# Altium project S7CAS-PLEIADES-CARTE-MERE_P06.PrjPcb (part 1 of 4)
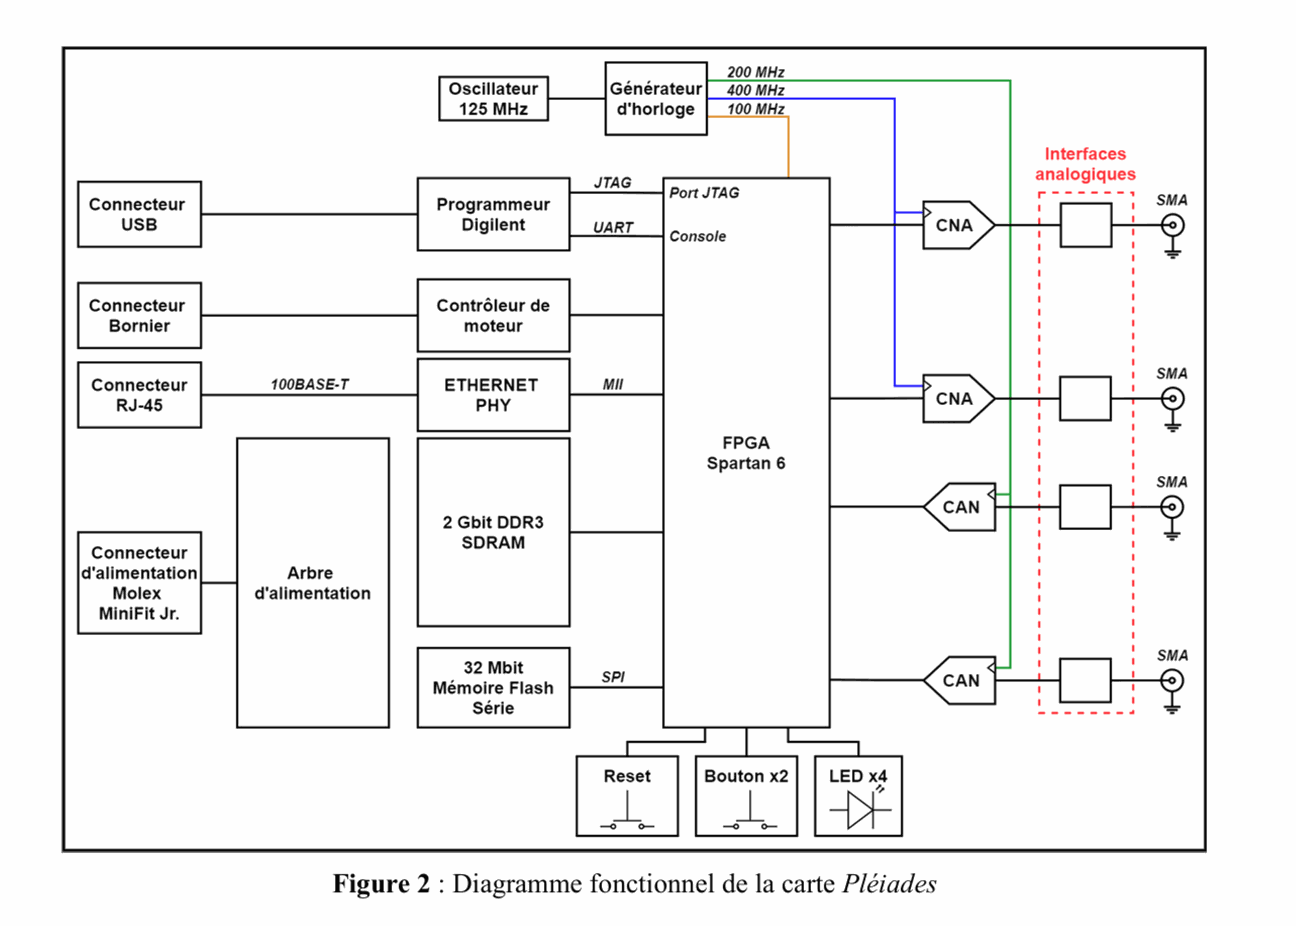
[diagram p0: S7CAS-PLEIADES-CARTE-MERE_P06_BLOCK_DIAGRAM.SchDoc]
Project_Date: 2026-01-21; Project_Designer1: Étienne Provencher; Project_Designer2: Antoine Allard; Project_Global: S7APP1-2; Project_Group: P-06; Project_Name: S7CAS-PLEIDES-CARTE-MERE_P06; Project_Revision: 1.00; Project_Stencil_Bot_Thickness: 3 Milliwhatever; Project_Stencil_Top_Thickness: 6-7 MacroMilsliliter
18 sheets, 469 parts. Net scope: flat (ports and power ports of the same name join across sheets).
Board file: S7CAS-PLEIADES-CARTE-MERE_P06.PcbDoc
Sheets:
  S7CAS-PLEIADES-CARTE-MERE_P06_TITLE.SchDoc
  S7CAS-PLEIADES-CARTE-MERE_P06_BLOCK_DIAGRAM.SchDoc
  S7CAS-PLEIADES-CARTE-MERE_P06_POWER_TREE.SchDoc
  S7CAS-PLEIADES-CARTE-MERE_P06_POWER1.SCHDOC
  S7CAS-PLEIADES-CARTE-MERE_P06_POWER2.SCHDOC
  S7CAS-PLEIADES-CARTE-MERE_P06_FPGA1.SCHDOC
  S7CAS-PLEIADES-CARTE-MERE_P06_FPGA2.SCHDOC
  S7CAS-PLEIADES-CARTE-MERE_P06_FPGA3.SCHDOC
  S7CAS-PLEIADES-CARTE-MERE_P06_FPGA4.SCHDOC
  S7CAS-PLEIADES-CARTE-MERE_P06_CLOCK.SchDoc
  S7CAS-PLEIADES-CARTE-MERE_P06_ETHERNET.SCHDOC
  S7CAS-PLEIADES-CARTE-MERE_P06_DDR3.SCHDOC
  S7CAS-PLEIADES-CARTE-MERE_P06_MOTOR.SCHDOC
  S7CAS-PLEIADES-CARTE-MERE_P06_MISC.SchDoc
  S7CAS-PLEIADES-CARTE-MERE_P06_FLASH.SCHDOC
  S7CAS-PLEIADES-CARTE-MERE_P06_ADC.SchDoc
  S7CAS-PLEIADES-CARTE-MERE_P06_DAC.SchDoc
  S7CAS-PLEIADES-CARTE-MERE_P06_USB_PROGRAMER.SCHDOC

## Sheet S7CAS-PLEIADES-CARTE-MERE_P06_TITLE.SchDoc
size Tabloid; SheetNumber: 1; SheetTotal: 18; Sheet_Name: Title; Size: 11x17

### Notes on the sheet
- Revision history
- Package size conversion
- Metric
- 1005
- 1608
- Imperial
- 0402
- 0603
- Revision
- 2012
- 3216
- 0805
- 1206
- 3225
- 6432
- 1210
- 2512
- Date :
- Project Title
- Global Project
- Size
- Group
- Date
- Sheet
- of
- Filename
- Designers

## Sheet S7CAS-PLEIADES-CARTE-MERE_P06_BLOCK_DIAGRAM.SchDoc
size Tabloid; SheetNumber: 2; SheetTotal: 17; Sheet_Name: BLOCK DIAGRAM; Size: 11x17

### Notes on the sheet
- Sheet Name
- Project Title
- Global Project
- Size
- Group
- Revision
- Date
- Sheet
- of
- Filename
- Designers

## Sheet S7CAS-PLEIADES-CARTE-MERE_P06_POWER_TREE.SchDoc
size Tabloid; SheetNumber: 3; SheetTotal: 18; Sheet_Name: POWER TREE; Size: 11x17
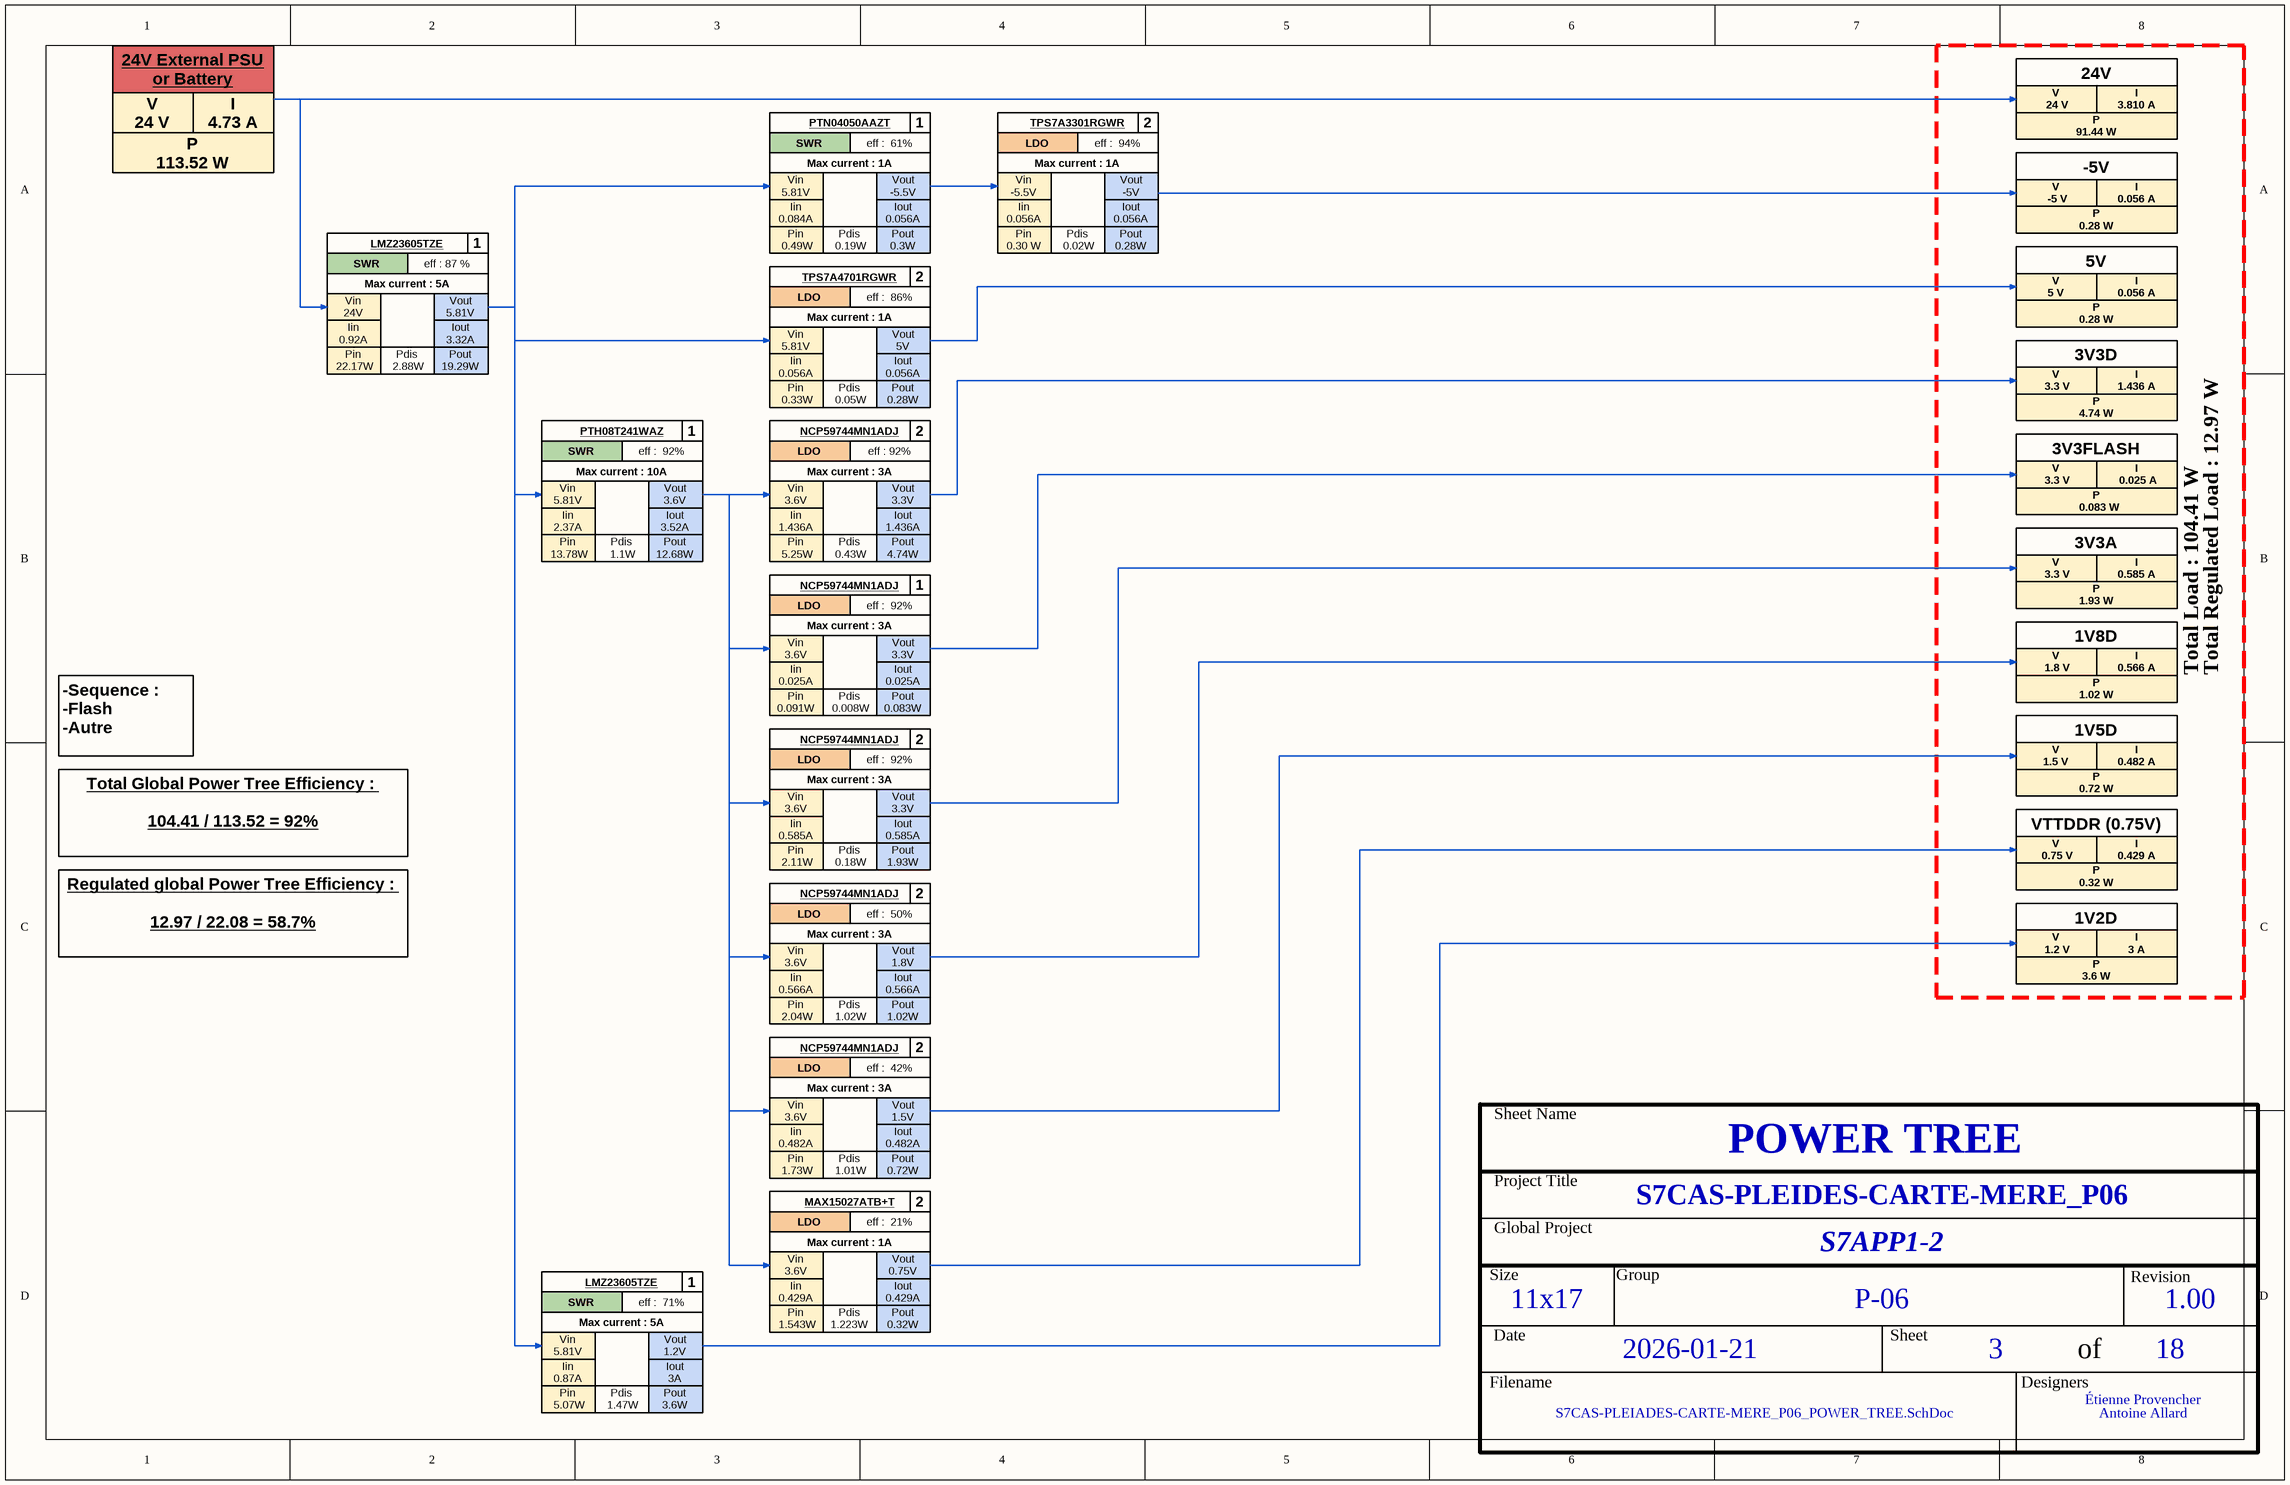
[diagram p1: S7CAS-PLEIADES-CARTE-MERE_P06_POWER_TREE.SchDoc]

### Notes on the sheet
- 24V External PSU
  or Battery
- 24V
- V
  24 V
- P
  113.52 W
- I
  4.73 A
- PTN04050AAZT
- SWR
- Max current : 1A
- eff :  61%
- 1
- LDO
- TPS7A3301RGWR
- eff :  94%
- 2
- P
  91.44 W
- I
  3.810 A
- Vin
  5.81V
- Iin
  0.084A
- Vout
  -5.5V
- Iout
  0.056A
- Vin
  -5.5V
- Iin
  0.056A
- Vout
  -5V
- -5V
- V
  -5 V
- P
  0.28 W
- I
  0.056 A
- LMZ23605TZE
- Max current : 5A
- eff : 87 %
- Pin
  0.49W
- TPS7A4701RGWR
- Pdis
  0.19W
- eff :  86%
- Pout
  0.3W
- Pin
  0.30 W
- Pdis
  0.02W
- Pout
  0.28W
- 5V
- V
  5 V
- Vin
  24V
- Iin
  0.92A
- Vout
  5.81V
- Iout
  3.32A
- Vout
  5V
- 3V3D
- Pin
  22.17W
- Pdis
  2.88W
- Pout
  19.29W
- PTH08T241WAZ
- Pin
  0.33W
- NCP59744MN1ADJ
- Pdis
  0.05W
- V
  3.3 V
- P
  4.74 W
- I
  1.436 A
- Max current : 10A
- eff :  92%
- Max current : 3A
- eff : 92%
- 3V3FLASH
- I
  0.025 A
- Iin
  2.37A
- Pin
  13.78W
- Pdis
  1.1W
- Vout
  3.6V
- Iout
  3.52A
- Pout
  12.68W
- Vin
  3.6V
- Iin
  1.436A
- Pin
  5.25W
- Pdis
  0.43W
- Vout
  3.3V
- Iout
  1.436A
- Pout
  4.74W
- 3V3A
- P
  0.083 W
- P
  1.93 W
- I
  0.585 A
- Iin
  0.025A
- Iout
  0.025A
- 1V8D
- V
  1.8 V
- P
  1.02 W
- I
  0.566 A
- Total Load : 104.41 W
- Total Regulated Load : 12.97 W
- -Sequence :
  -Flash
  -Autre
- Pin
  0.091W
- Pdis
  0.008W
- Pout
  0.083W
- 1V5D
- V
  1.5 V
- I
  0.482 A
- Iin
  0.585A
- Iout
  0.585A
- P
  0.72 W
- VTTDDR (0.75V)
- Total Global Power Tree Efficiency :
  104.41 / 113.52 = 92%
- Pin
  2.11W
- Pdis
  0.18W
- Pout
  1.93W
- V
  0.75 V
- P
  0.32 W
- I
  0.429 A
- Regulated global Power Tree Efficiency :
  12.97 / 22.08 = 58.7%
- eff :  50%
- Vout
  1.8V
- 1V2D
- V
  1.2 V
- I
  3 A
- Iin
  0.566A
- Pin
  2.04W
- Pdis
  1.02W
- Iout
  0.566A
- Pout
  1.02W
- P
  3.6 W
- eff :  42%
- Iin
  0.482A
- Vout
  1.5V
- Iout
  0.482A
- MAX15027ATB+T
- Pin
  1.73W
- Pdis
  1.01W
- eff :  21%
- Pout
  0.72W
- Iin
  0.429A
- Vout
  0.75V
- Iout
  0.429A
- eff :  71%
- Vout
  1.2V
- Pin
  1.543W
- Pdis
  1.223W
- Pout
  0.32W
- Iin
  0.87A
- Pin
  5.07W
- Pdis
  1.47W
- Iout
  3A
- Pout
  3.6W
- Sheet Name
- Project Title
- Global Project
- Size
- Group
- Revision
- Date
- Sheet
- of
- Filename
- Designers

## Sheet S7CAS-PLEIADES-CARTE-MERE_P06_POWER1.SCHDOC
size Tabloid; SheetNumber: 4; SheetTotal: 18; Sheet_Name: POWER 1; Size: 11x17
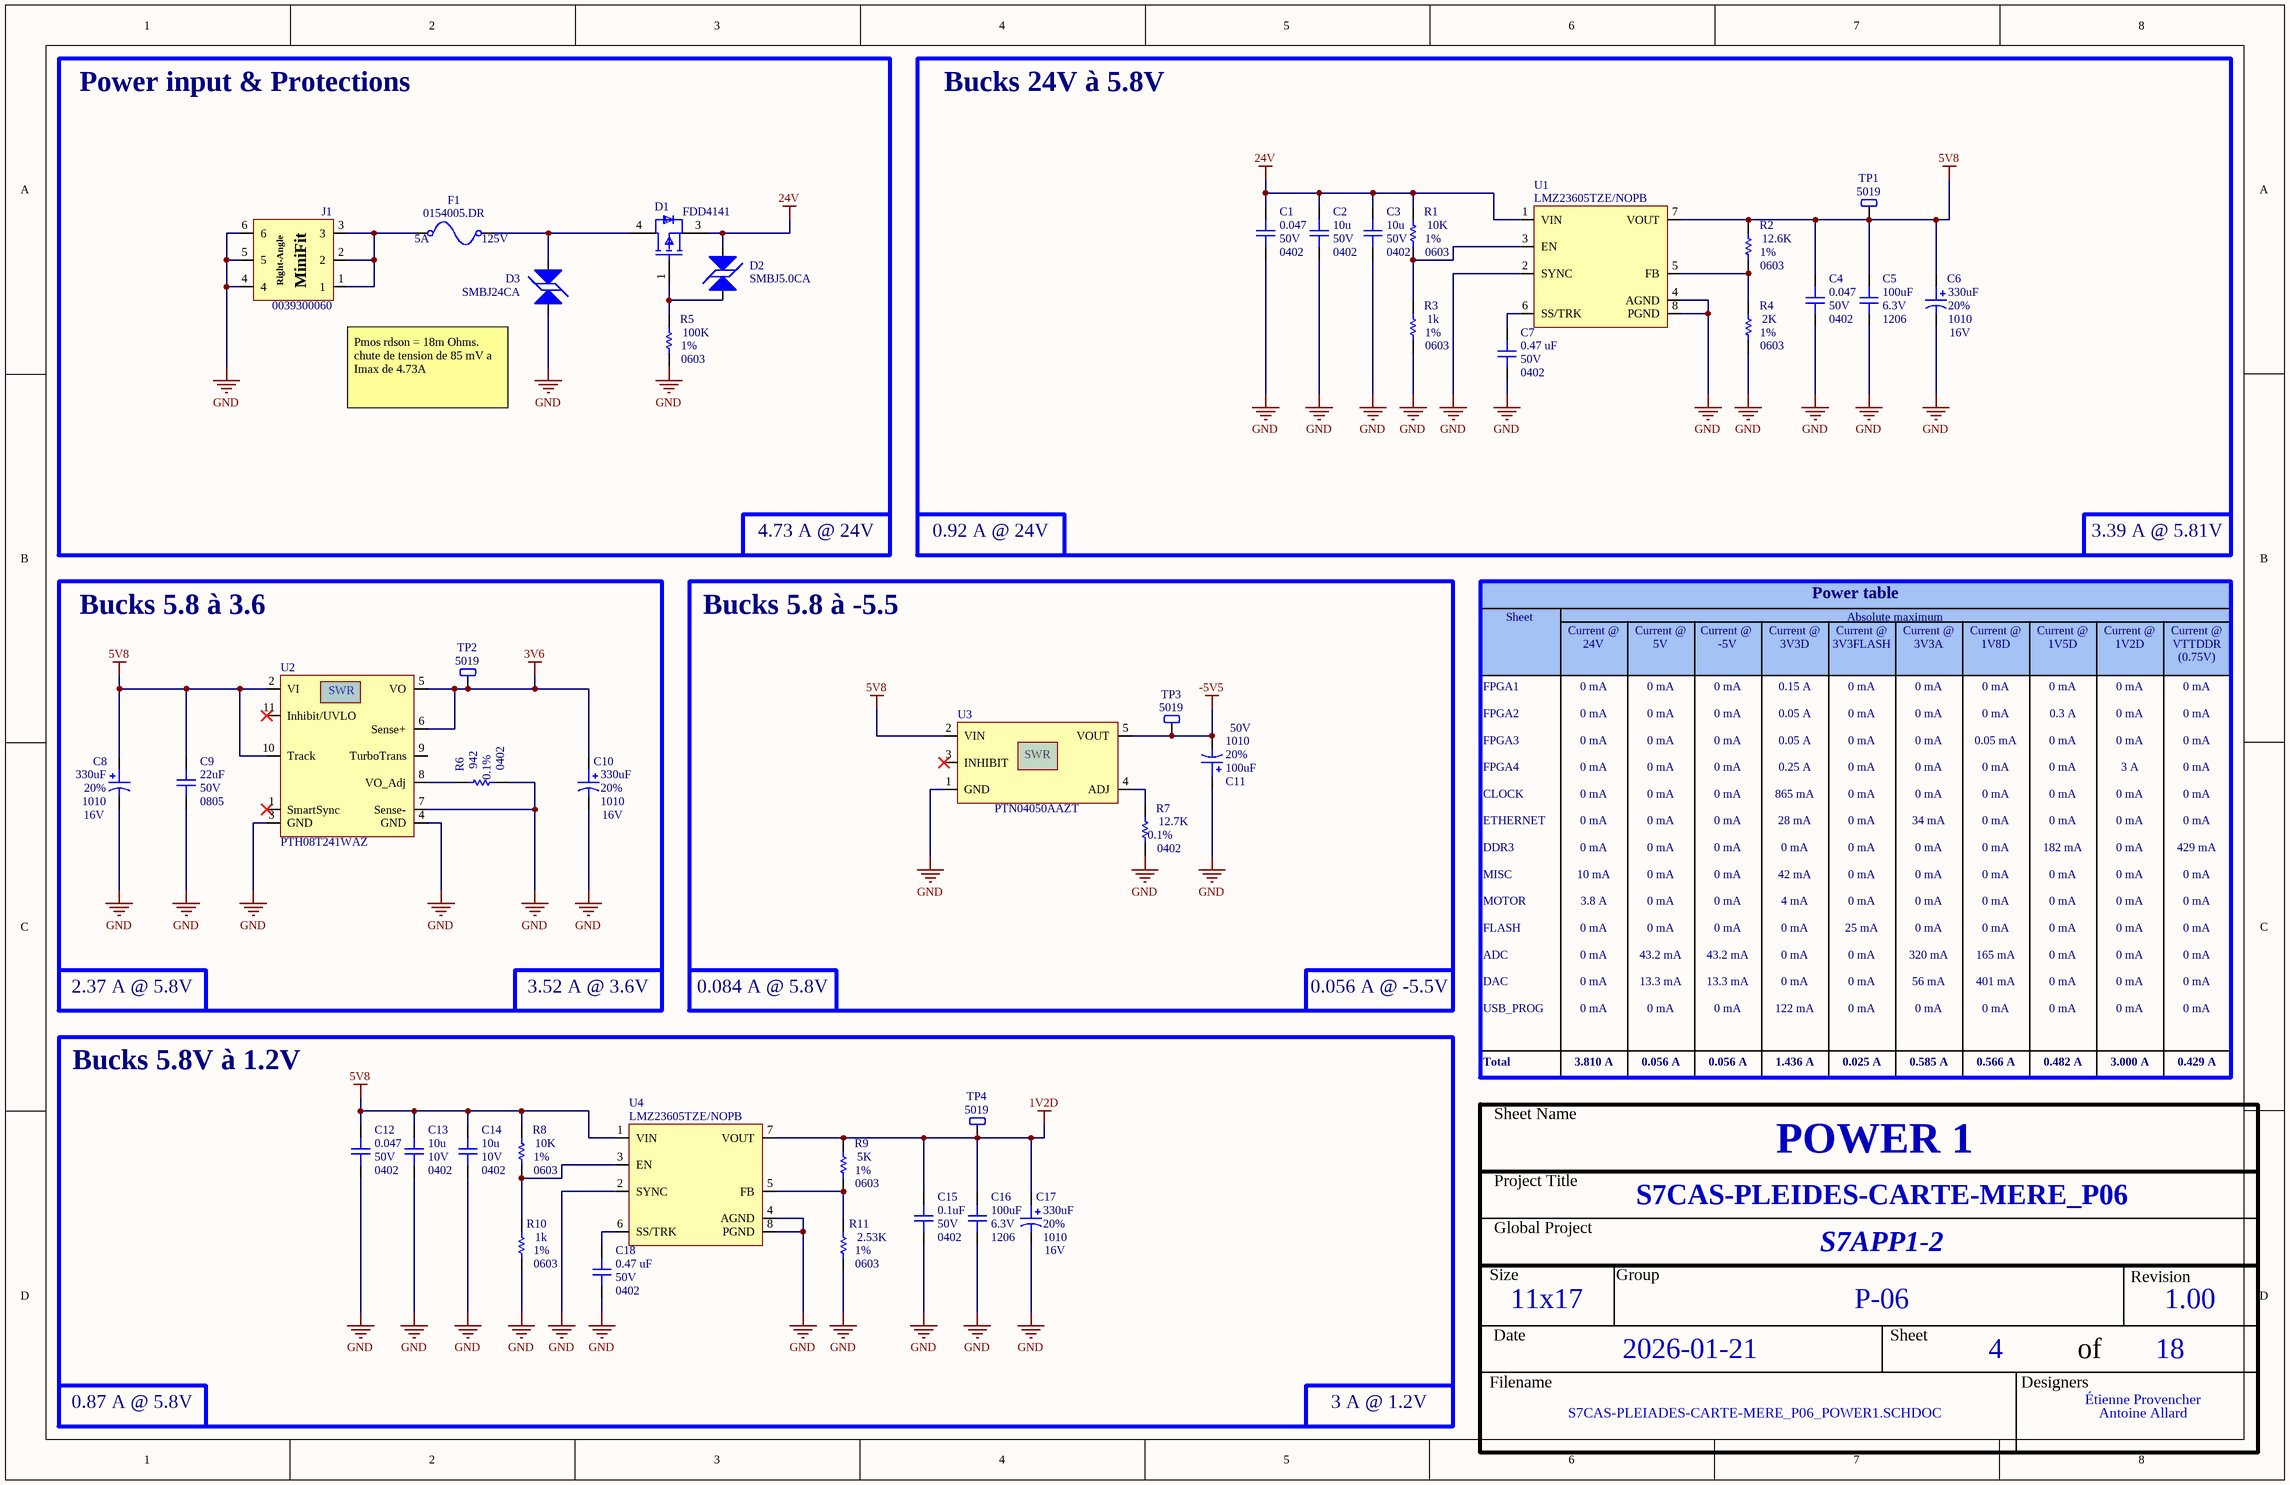
[diagram p2: S7CAS-PLEIADES-CARTE-MERE_P06_POWER1.SCHDOC]

### Parts
C1  value 0.047  Voltage: 50V  Package: 0402  [CAP_0402]  (hidden comment: CAP - 0402)
C2  value 10u  Voltage: 50V  Package: 0402  [CAP_0402]  (hidden comment: CAP - 0402)
C3  value 10u  Voltage: 50V  Package: 0402  [CAP_0402]  (hidden comment: CAP - 0402)
C4  value 0.047  Voltage: 50V  Package: 0402  [CAP_0402]  (hidden comment: CAP - 0402)
C5  value 100uF  Voltage: 6.3V  Package: 1206  [CAP_1206]  (hidden comment: CAP - 1206)
C6  value 330uF  Voltage: 16V  Package: 1010  Precision: 20%  [CAP_ALU_1010_vishay]  (hidden comment: MAL214699501E3)
C7  value 0.47 uF  Voltage: 50V  Package: 0402  [CAP_0402]  (hidden comment: CAP - 0402)
C8  value 330uF  Voltage: 16V  Package: 1010  Precision: 20%  [CAP_ALU_1010_vishay]  (hidden comment: MAL214699501E3)
C9  value 22uF  Voltage: 50V  Package: 0805  [CAP_0805]  (hidden comment: CAP - 0805)
C10  value 330uF  Voltage: 16V  Package: 1010  Precision: 20%  [CAP_ALU_1010_vishay]  (hidden comment: MAL214699501E3)
C11  value 100uF  Voltage: 50V  Package: 1010  Precision: 20%  [CAP_ALU_1010_vishay]  (hidden comment: MAL215099101E3)
C12  value 0.047  Voltage: 50V  Package: 0402  [CAP_0402]  (hidden comment: CAP - 0402)
C13  value 10u  Voltage: 10V  Package: 0402  [CAP_0402]  (hidden comment: CAP - 0402)
C14  value 10u  Voltage: 10V  Package: 0402  [CAP_0402]  (hidden comment: CAP - 0402)
C15  value 0.1uF  Voltage: 50V  Package: 0402  [CAP_0402]  (hidden comment: CAP - 0402)
C16  value 100uF  Voltage: 6.3V  Package: 1206  [CAP_1206]  (hidden comment: CAP - 1206)
C17  value 330uF  Voltage: 16V  Package: 1010  Precision: 20%  [CAP_ALU_1010_vishay]  (hidden comment: MAL214699501E3)
C18  value 0.47 uF  Voltage: 50V  Package: 0402  [CAP_0402]  (hidden comment: CAP - 0402)
D1  FDD4141  [FP-369AS-MFG]
D2  SMBJ5.0CA  [TVS_PWR_SMBJ5.0CA]
D3  SMBJ24CA  [TVS_PWR_SMBJ36CA]
F1  0154005.DR  Voltage Rating: 125V  Current Rating: 5A  [FUS_0154XXX.DR]
J1  0039300060  [CON_MINIFIT_0039300060]
R1  value 10K  Package: 0603  Precision: 1%  [RES_0603]  (hidden comment: RES - 0603)
R2  value 12.6K  Package: 0603  Precision: 1%  [RES_0603]  (hidden comment: RES - 0603)
R3  value 1k  Package: 0603  Precision: 1%  [RES_0603]  (hidden comment: RES - 0603)
R4  value 2K  Package: 0603  Precision: 1%  [RES_0603]  (hidden comment: RES - 0603)
R5  value 100K  Package: 0603  Precision: 1%  [RES_0603]  (hidden comment: RES - 0603)
R6  value 942  Package: 0402  Precision: 0.1%  [RES_0402]  (hidden comment: RES - 0402)
R7  value 12.7K  Package: 0402  Precision: 0.1%  [RES_0402]  (hidden comment: RES - 0402)
R8  value 10K  Package: 0603  Precision: 1%  [RES_0603]  (hidden comment: RES - 0603)
R9  value 5K  Package: 0603  Precision: 1%  [RES_0603]  (hidden comment: RES - 0603)
R10  value 1k  Package: 0603  Precision: 1%  [RES_0603]  (hidden comment: RES - 0603)
R11  value 2.53K  Package: 0603  Precision: 1%  [RES_0603]  (hidden comment: RES - 0603)
TP1  5019  [TPO_SMD_5019]
TP2  5019  [TPO_SMD_5019]
TP3  5019  [TPO_SMD_5019]
TP4  5019  [TPO_SMD_5019]
U1  LMZ23605TZE/NOPB  [REG_SWR_LMZ23605TZE/NOPB]
U2  PTH08T241WAZ  [REG_SWR_PTH08T241WAZ]
U3  PTN04050AAZT  [REG_SWR_PTN04050AAZT]
U4  LMZ23605TZE/NOPB  [REG_SWR_LMZ23605TZE/NOPB]

### Blocks framed on the sheet
Power input & Protections: D1-D3 F1 J1 R5
Bucks 24V à 5.8V: C1-C7 R1-R4 TP1 U1
Bucks 5.8 à 3.6: C8-C10 R6 TP2 U2
Bucks 5.8 à -5.5: C11 R7 TP3 U3
Bucks 5.8V à 1.2V: C12-C18 R8-R11 TP4 U4

### Nets
1V2D: C15.2 C16.2 C17.1 R9.2 TP4.1 U4.7(VOUT)
3V6: C10.1 TP2.1 U2.5(VO) U2.6(Sense+)
5V8: C4.2 C5.2 C6.1 C8.1 C9.2 C12.2 C13.2 C14.2 R2.2 R8.2 TP1.1 U1.7(VOUT) U2.2(VI) U2.10(Track) U3.2(VIN) U4.1(VIN)
24V: C1.2 C2.2 C3.2 D1.3(S) D2.1 R1.2 U1.1(VIN)
-5V5: C11.2 TP3.1 U3.5(VOUT)
GND: C1.1 C2.1 C3.1 C4.1 C5.1 C6.2 C7.1 C8.2 C9.1 C10.2 C11.1 C12.1 C13.1 C14.1 C15.1 C16.1 C17.2 C18.1 D3.2 J1.4 J1.5 J1.6 R3.1 R4.1 R5.1 R6.1 R7.1 R10.1 R11.1 U1.2(SYNC) U1.4(AGND) U1.8(PGND) U2.3(GND) U2.4(GND) U2.7(Sense-) U3.1(GND) U4.2(SYNC) U4.4(AGND) U4.8(PGND)
NetC7_2: C7.2 U1.6(SS/TRK)
NetC18_2: C18.2 U4.6(SS/TRK)
NetD1_1: D1.1(G) D2.2 R5.2
NetD1_4: D1.4(D) D3.1 F1.2
NetF1_1: F1.1 J1.1 J1.2 J1.3
NetR1_1: R1.1 R3.2 U1.3(EN)
NetR2_1: R2.1 R4.2 U1.5(FB)
NetR6_2: R6.2 U2.8(VO_Adj)
NetR7_2: R7.2 U3.4(ADJ)
NetR8_1: R8.1 R10.2 U4.3(EN)
NetR9_1: R9.1 R11.2 U4.5(FB)

Not connected (* = marked no-connect by the designer): U2 1(SmartSync)* 9(TurboTrans) 11(Inhibit/UVLO)*; U3 3(INHIBIT)*

### Notes on the sheet
- Pmos rdson = 18m Ohms. chute de tension de 85 mV a Imax de 4.73A
- 4.73 A @ 24V
- 0.92 A @ 24V
- 3.39 A @ 5.81V
- Power table
- Absolute maximum
- Sheet
- Current @ 24V
- Current @ 5V
- Current @
  -5V
- Current @ 3V3D
- Current @ 3V3FLASH
- Current @ 3V3A
- Current @ 1V8D
- Current @ 1V5D
- Current @ 1V2D
- Current @ VTTDDR
  (0.75V)
- 2.37 A @ 5.8V
- 3.52 A @ 3.6V
- 0.084 A @ 5.8V
- 0.056 A @ -5.5V
- FPGA1
  FPGA2
  FPGA3
  FPGA4
  CLOCK
  ETHERNET
  DDR3
  MISC
  MOTOR
  FLASH
  ADC
  DAC
  USB_PROG
- Total
- 0 mA
  0 mA
  0 mA
  0 mA
  0 mA
  0 mA
  0 mA
  10 mA
  3.8 A
  0 mA
  0 mA
  0 mA
  0 mA
- 3.810 A
- 0.056 A
- 0 mA
  0 mA
  0 mA
  0 mA
  0 mA
  0 mA
  0 mA
  0 mA
  0 mA
  0 mA
  43.2 mA
  13.3 mA
  0 mA
- 1.436 A
- 0.15 A
  0.05 A
  0.05 A
  0.25 A
  865 mA
  28 mA
  0 mA
  42 mA
  4 mA
  0 mA
  0 mA
  0 mA
  122 mA
- 0.025 A
- 0 mA
  0 mA
  0 mA
  0 mA
  0 mA
  0 mA
  0 mA
  0 mA
  0 mA
  25 mA
  0 mA
  0 mA
  0 mA
- 0.585 A
- 0 mA
  0 mA
  0 mA
  0 mA
  0 mA
  34 mA
  0 mA
  0 mA
  0 mA
  0 mA
  320 mA
  56 mA
  0 mA
- 0.566 A
- 0 mA
  0 mA
  0.05 mA
  0 mA
  0 mA
  0 mA
  0 mA
  0 mA
  0 mA
  0 mA
  165 mA
  401 mA
  0 mA
- 0.482 A
- 0 mA
  0.3 A
  0 mA
  0 mA
  0 mA
  0 mA
  182 mA
  0 mA
  0 mA
  0 mA
  0 mA
  0 mA
  0 mA
- 3.000 A
- 0 mA
  0 mA
  0 mA
  3 A
  0 mA
  0 mA
  0 mA
  0 mA
  0 mA
  0 mA
  0 mA
  0 mA
  0 mA
- 0.429 A
- 0 mA
  0 mA
  0 mA
  0 mA
  0 mA
  0 mA
  429 mA
  0 mA
  0 mA
  0 mA
  0 mA
  0 mA
  0 mA
- 0.87 A @ 5.8V
- 3 A @ 1.2V
- Sheet Name
- Project Title
- Global Project
- Size
- Group
- Revision
- Date
- of
- Filename
- Designers
- (in symbol CON_MINIFIT_0039300060) Right-Angle; MiniFit
- (in symbol REG_SWR_PTH08T241WAZ) SWR
- (in symbol REG_SWR_PTN04050AAZT) SWR

### Library data of the parts
C1-C4 C7 C12-C15 C18 = CAP - 0402: Precision: 10%; Current: *; CreatedBy: Jonathan Bouchard; Power: *
C5 C16 = CAP - 1206: Precision: 10%; Current: *; CreatedBy: Jonathan Bouchard; Power: *
C6 C8 C10 C17 = CAP_ALU_MAL214699501E3: CAP - ALU 330uF 20% 16V - 1010; Current: 750mA; Mfg: Vishay Dale; Mfg Part Number: MAL214699501E3; HelpURL: http://www.vishay.com/docs/28403/146cti.pdf; CreatedBy: Jonathan Bouchard; Temperature: -55°C to 125°C; Power: *; Supplier 1: Digikey; Supplier Part Number 1: 4405PHCT-ND
C9 = CAP - 0805: Precision: 10%; Current: *; CreatedBy: Jonathan Bouchard; Power: *
C11 = CAP_ALU_MAL215099101E3: CAP - ALU 100uF 20% 50V - 1010; Current: 490mA; Mfg: Vishay Dale; Mfg Part Number: MAL215099101E3; HelpURL: http://www.vishay.com/docs/28395/150crz.pdf; CreatedBy: Jonathan Bouchard; Temperature: -55°C to 125°C; Power: *; Supplier 1: Digikey; Supplier Part Number 1: 4399PHDKR-ND
D1 = CMP-07173-000088-1: MOSFET P-CH 40V 10.8A DPAK; Manufacturer: ON Semiconductor; Gate Charge At Vgs: 36nC @ -10V; Transconductance: 38S; Drain To Source Breakdown Voltage: -40V; Reverse Recovery Time: 29ns; Pulse Drain Current: -100A; Reverse Recovery Charge: 26nC; Drain To Source Resistance: 10.1mΩ; Power Dissipation: 2.4W; Max Forward Diode Voltage: -1.2V; Turn Off Delay Time: 38ns; Number Of P Channels: 1; Gate To Source Voltage: 20V; Rthja Max: 52°C/W; Depletion Mode: False; Threshold Vgs Max: -3V; Threshold Vgs Min: -1V; Turn On Delay Time: 10ns; Max Junction Temp: +150°C; Input Capacitace At Vds: 2085pF @ -20V; Continuous Drain Current: -10.8A; Typ Forward Diode Voltage: -0.8V; Package: 369AS; Category: Diode; RoHS: TRUE; Device Class L2: Transistors; Octopart: https://octopart.com/fdd4141-on+semiconductor-84325802; Temperature: -55°C to +150°C; Drain To Source Voltage: -40V; Device Class L1: Discrete Semiconductors; Temperature Range Low: -55°C; Height: 2.517mm; ComponentLink2Description: Datasheet; Automotive: No; Number Of Channels: 1; Digikey Description: MOSFET P-CH 40V 10.8A DPAK; Lead Free: Yes; Manufacturer Part Number: FDD4141; Temperature Range High: +150°C; Footprint Url: https://www.onsemi.com/pub/Collateral/369AS.PDF; Device Class L3: MOSFETs; Mouser Description: MOSFET -40V P-Channel PowerTrench; ComponentLink2URL: https://www.onsemi.com/pub/Collateral/FDD4141-D.pdf
D2 = TVS_PWR_SMBJ5.0CA: TVS - BIDIR 5V 9.2V 600W - DO214AA; Manufacturer #1: Littelfuse Inc.; Value: Vbr = 6.4V -  Clamp = 9.2V; Voltage Rating: 5V Standoff; Current Rating: 65.3 A (Ipp); Power Max: 600W (Pppm); GRAMS Lib Spec: 2.8; Magnetic Material: UNKNOWN; Polarized: NO; Tolerance: *; HelpURL: http://www.littelfuse.com/~/media/electronics/datasheets/tvs_diodes/littelfuse_tvs_diode_smbj_datasheet.pdf.pdf; CreatedBy/Date: Jonathan Bouchard - 2019-03-22; VerifiedBy: Nicolas V. (2019-05-06); Temperature: -65°C ~ 150°C (TJ); Package: DO214AA; Manufacturer #2: *; Note: *; Assembly Type: SMD; Part Number #2: *; Part Number #1: SMBJ5.0CA; Supplier 1: Digi-Key; Supplier Part Number 1: SMBJ5.0CALFCT-ND; Cryo: UNKNOWN
D3 = TVS_PWR_SMBJ24CA: TVS - 24V 26.7V 600W - DO214AA; Manufacturer #1: Littelfuse Inc.; Value: Vbr = 26.7V -  Clamp = 38.9V; Voltage Rating: 24V Standoff; Current Rating: 15.5A; GRAMS Lib Spec: 2.8; Magnetic Material: UNKNOWN; Polarized: NO; Tolerance: *; Power Max: 600W; HelpURL: http://www.littelfuse.com/~/media/electronics/datasheets/tvs_diodes/littelfuse_tvs_diode_smbj_datasheet.pdf.pdf; CreatedBy/Date: Arnaud Samson - 06/07/18; VerifiedBy: Jonathan Bouchard - 2018-07-13; Temperature: -65°C ~ 150°C (TJ); Package: DO214AA; Manufacturer #2: *; Note: *; Assembly Type: SMD; Part Number #2: *; Part Number #1: SMBJ24CA; Supplier 1: Digi-Key; Supplier Part Number 1: SMBJ24CALFCT-ND; Cryo: UNKNOWN
F1 = FUS_0154005.DR: FUS - 5 A 125 VAC/VDC - 2-SMD; Manufacturer #1: Littelfuse Inc.; Value: 5A 125V AC/DC FAST; GRAMS Lib Spec: 2.8; Magnetic Material: UNKNOWN; Polarized: NO; Tolerance: *; Power Max: *; HelpURL: http://www.littelfuse.com/~/media/electronics/datasheets/fuses/littelfuse_fuse_154_154t_154l_154tl_datasheet.pdf.pdf; CreatedBy/Date: Arnaud Samson - 06/07/18; VerifiedBy: Jonathan Bouchard 2018-07-16; Temperature: -55°C ~ 125°C; Package: 2-SMD; Manufacturer #2: *; Note: *; Assembly Type: SMD; Part Number #2: *; Part Number #1: 0154005.DR; Supplier 1: Digi-Key; Supplier Part Number 1: F1228CT-ND; Cryo: UNKNOWN
J1 = CON_MINIFIT_0039300060: CON - Mini-Fit Through Hole, Right Angle 6 position; Manufacturer #1: Molex; Current Rating: 8A; GRAMS Lib Spec: 2.8; Magnetic Material: Unknown; Polarized: Yes; Voltage Rating: 600V; Assembly Type: TH; CreatedBy/Date: Joel Lemay 2018-06-21; HelpURL: https://www.molex.com/pdm_docs/sd/039300060_sd.pdf; Manufacturer #2: *; Package: TH; Part Number #1: 0039300060; Part Number #2: *; Power Max: *; Supplier 1: Digi-Key; Supplier Part Number 1: WM21353-ND; Temperature: - 40°C to + 80°C; Tolerance: *; Value: *; VerifiedBy: Caroline Paulin - 10 sept 2018; Cryo: UNKNOWN
R6 R7 = RES - 0402: Voltage: 50V; Power: 1/16W; Current: *; CreatedBy: Jonathan Bouchard
TP1-TP4 = TPO_SMD_5019: TPO - PC TEST POINT MINI - SMD; Manufacturer #1: Keystone Electronics; Value: 3.81mm x 2.03mm; Polarized: No; Magnetic Material: UNKNOWN; GRAMS Lib Spec: 2.8; Current Rating: *; Manufacturer #2: *; Note: *; Power Max: *; Part Number #2: *; HelpURL: https://www.digikey.ca/product-detail/en/keystone-electronics/5019/36-5019CT-ND/3907344; Supplier 1: Digi-Key; Supplier Part Number 1: 36-5019CT-ND; Assembly Type: SMD; Part Number #1: 5019; Package: SMD; CreatedBy/Date: Olivier Bernard / 5/12/2017; Temperature: *; Tolerance: *; VerifiedBy: Caroline Paulin / 5 juillet 2018; Voltage Rating: *; Cryo: UNKNOWN
U1 U4 = REG_SWR_LMZ23605TZE/NOPB: REG - IC BUCK SYNC 36V 5A - TO-PMOD-7; Manufacturer #1: Texas Instruments; Value: 0.8 ~ 6 V; Voltage Rating: 6 ~ 36 V; GRAMS Lib Spec: 2.8; Note: One Reflow; Magnetic Material: YES; Cryo: UNKNOWN; Tolerance: *; Current Rating: 5A; Power Max: *; HelpURL: http://www.ti.com/lit/ds/symlink/lmz23605.pdf; CreatedBy/Date: Arnaud Samson - 05/07/18; VerifiedBy: Jonathan Bouchard 2018-07-13; Temperature: -40°C ~ 125°C; Package: TO-PMOD-7; Manufacturer #2: *; Assembly Type: SMD; Part Number #2: *; Part Number #1: LMZ23605TZE/NOPB; Polarized: YES; Supplier 1: Digi-Key; Supplier Part Number 1: 296-35357-1-ND
U2 = REG_SWR_PTH08T241WAZ: REG - MODULE PIP 10A 14VIN - 11-SMD; Manufacturer #1: Texas Instruments; Current Rating: 10A (out); Voltage rating: 4.5-14V (Input), 0.69 - 5.5V (Out); Polarized: Yes; Magnetic Material: UNKNOWN; Manufacturer #2: *; Note: *; Power Max: *; Value: *; Part Number #1: PTH08T241WAZ; Part Number #2: *; HelpURL: http://www.ti.com/lit/ds/symlink/pth08t241w.pdf; Supplier 1: Digi-Key; Supplier Part Number 1: 296-21339-ND; Assembly Type: SMD; Temperature: -40°C ~ 85°C; Package: SMD; CreatedBy/Date: Olivier Bernard / 6/5/2018; VerifiedBy: Caroline Paulin / 10 juillet 2018; Cryo: UNKNOWN
U3 = REG_SWR_PTN04050AAZT: REG - SWR -15 ~ -3.3V 1A 6W - 5-SMD; Manufacturer #1: Texas Instruments; Voltage Rating: 2.9V~7Vin; GRAMS Lib Spec: 2.8; Magnetic Material: Unknown; Polarized: Yes; Value: -15 ~ -3.3V; Tolerance: *; Current Rating: 1A; Power Max: 6W; HelpURL: http://www.ti.com/lit/ds/symlink/ptn04050a.pdf; CreatedBy/Date: Ihsane Najahi 2019-09-25; VerifiedBy: C.Paulin (9-10-2019); Temperature: -40°C ~ 85°C; Package: 5-SMD; Manufacturer #2: *; Note: *; Assembly Type: 5-SMD; Part Number #2: *; Part Number #1: PTN04050AAZT; Supplier 1: Digi-Key; Supplier Part Number 1: 296-32208-1-ND; Cryo: UNKNOWN
R1-R5 R8-R11 = RES - 0603: Current: *; CreatedBy: Jonathan Bouchard

## Sheet S7CAS-PLEIADES-CARTE-MERE_P06_POWER2.SCHDOC
size Tabloid; SheetNumber: 5; SheetTotal: 18; Sheet_Name: POWER 2; Size: 11x17
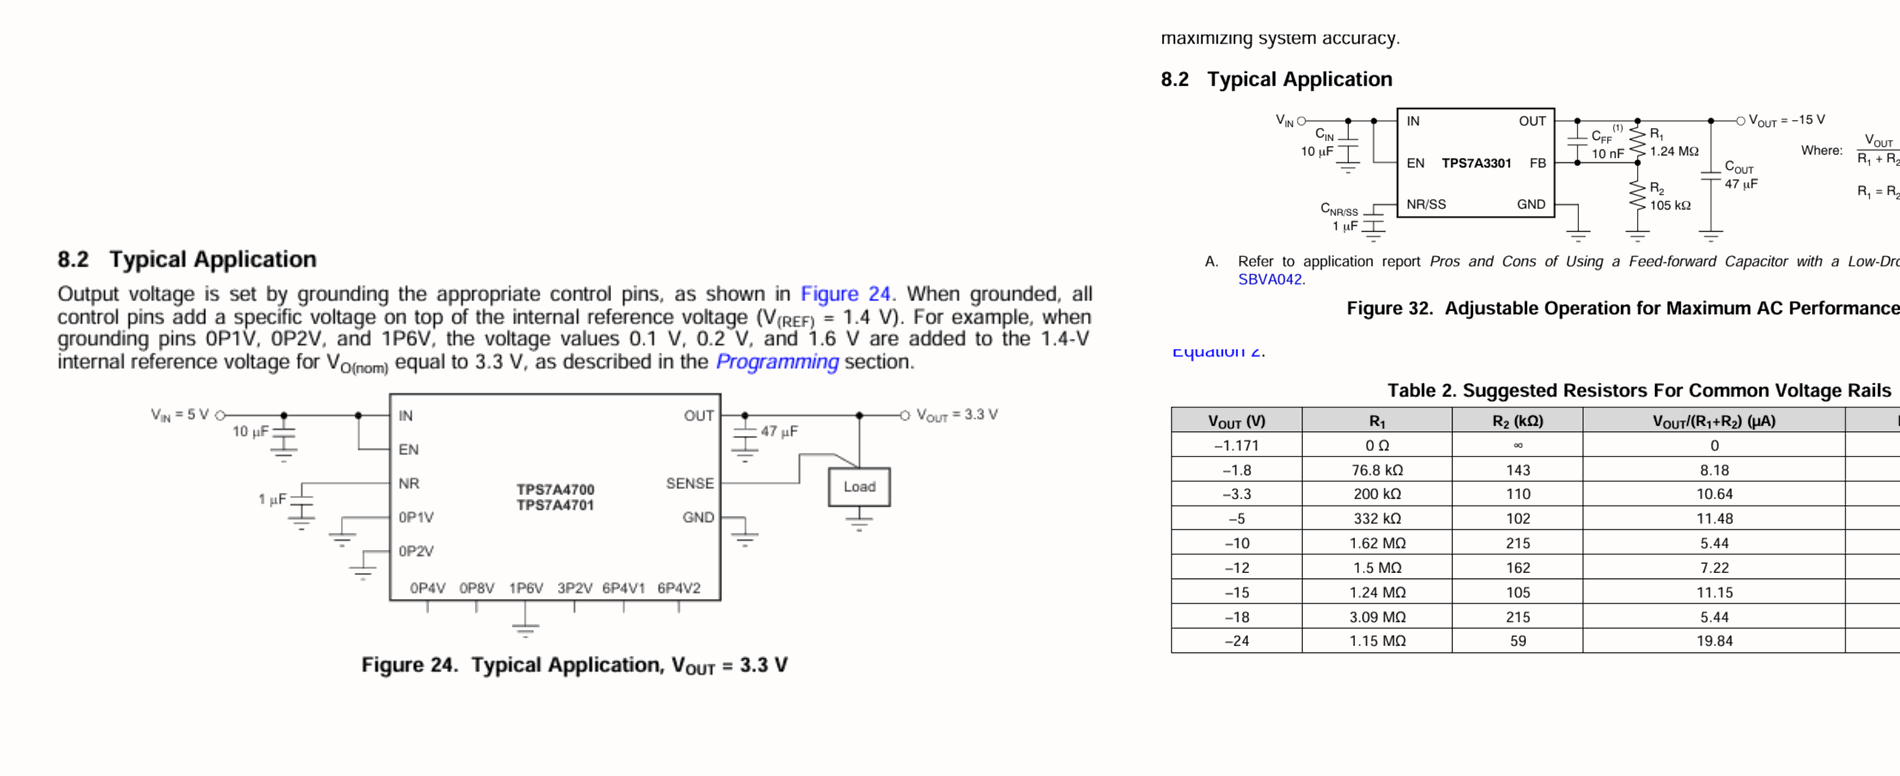
[diagram p3: S7CAS-PLEIADES-CARTE-MERE_P06_POWER2.SCHDOC, top left]
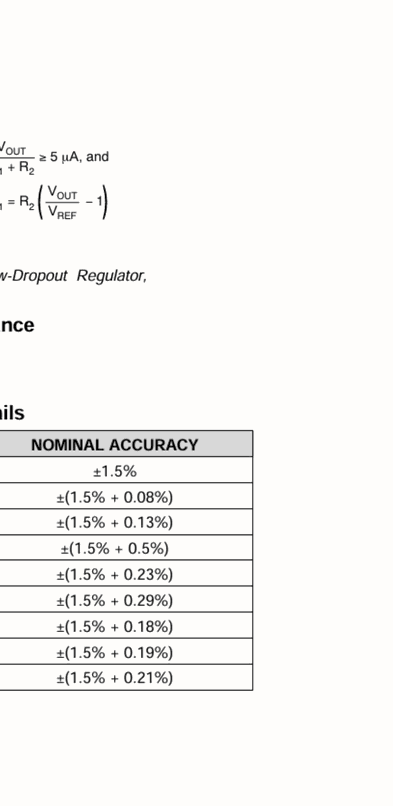
[diagram p4: S7CAS-PLEIADES-CARTE-MERE_P06_POWER2.SCHDOC, top right]
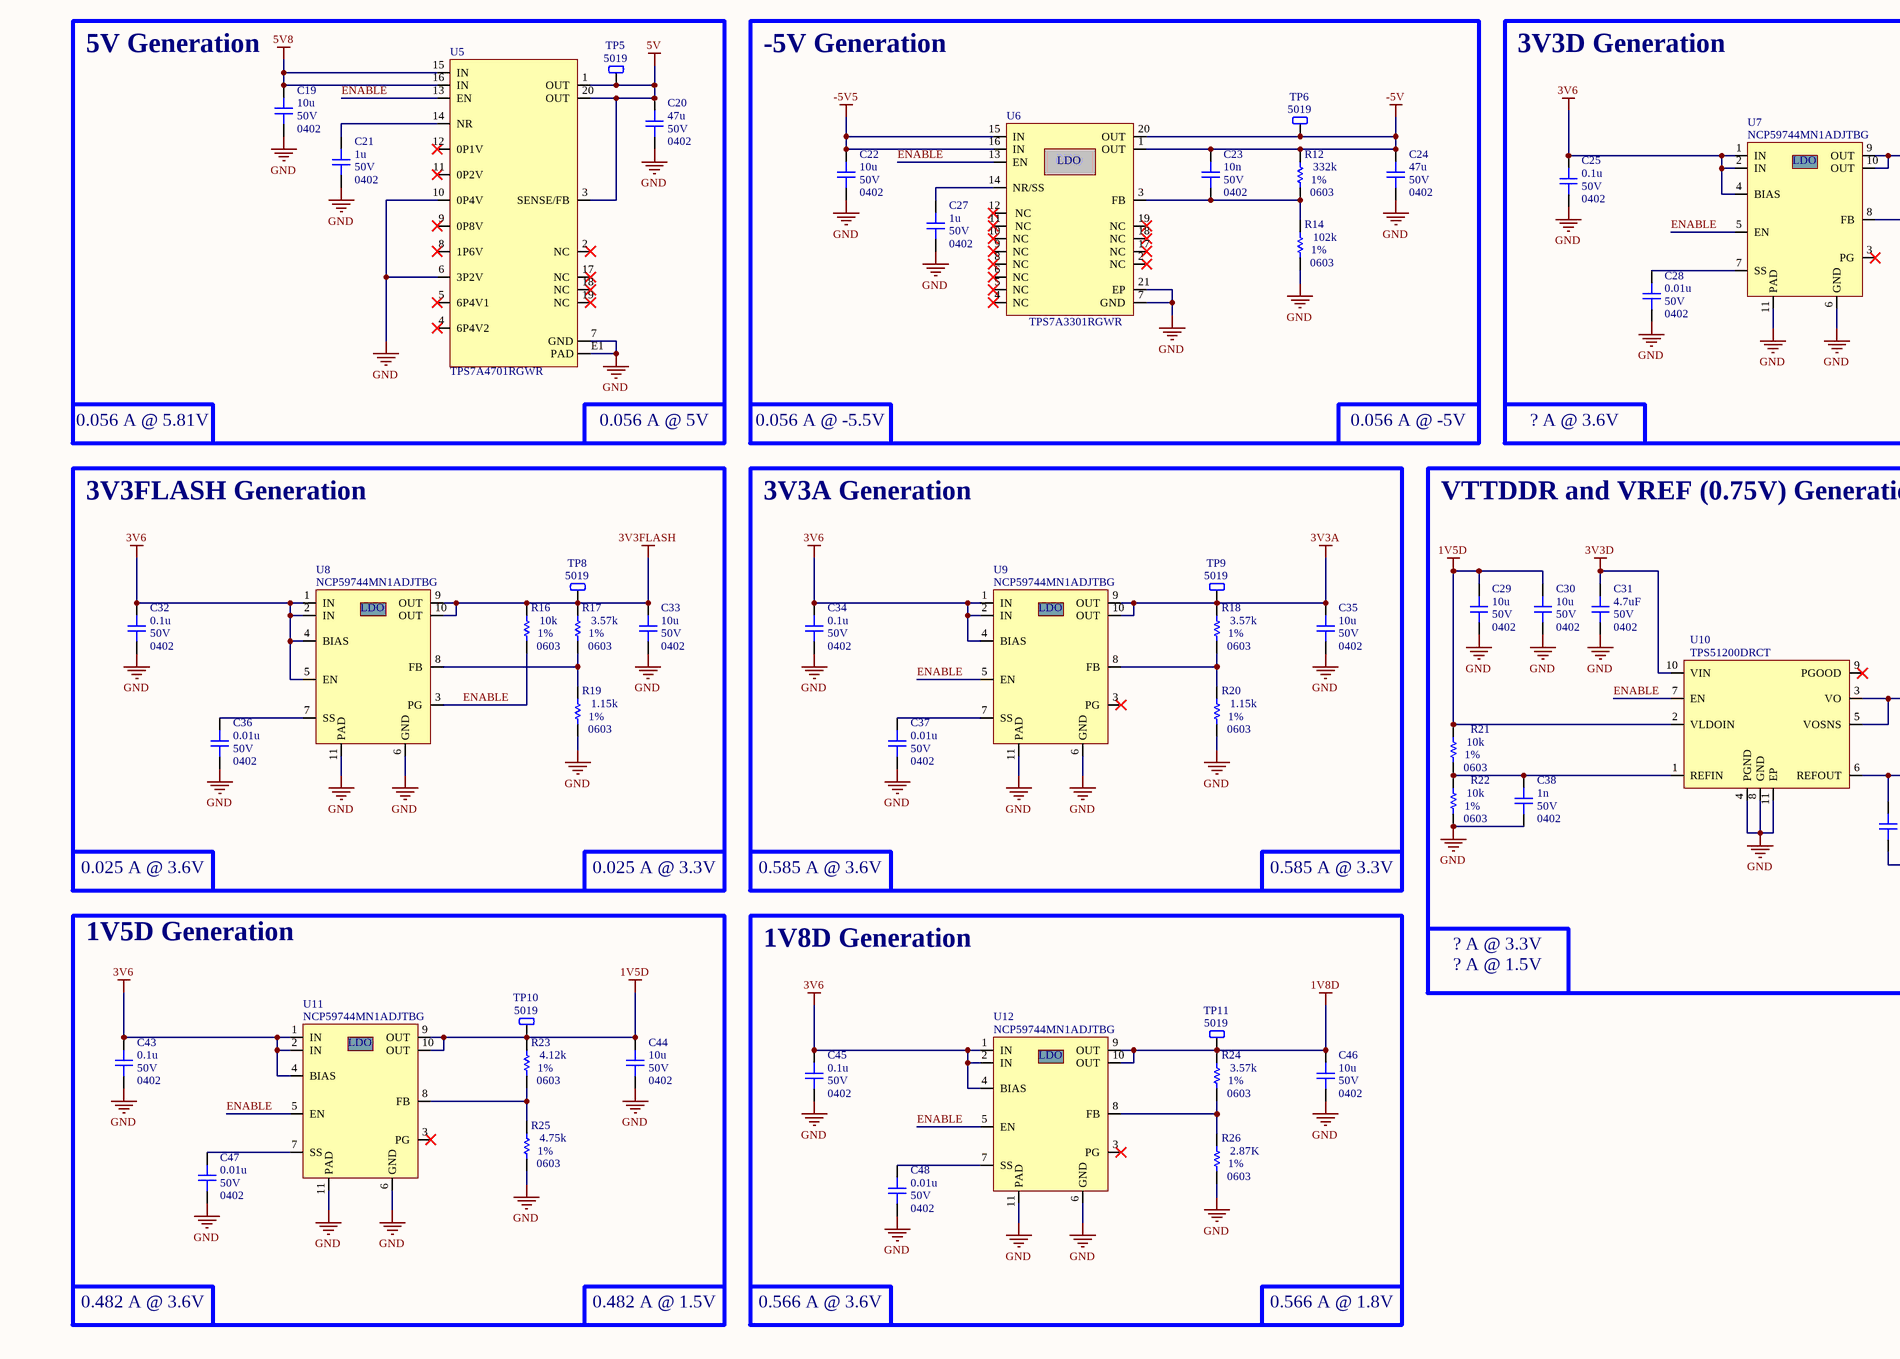
[diagram p5: S7CAS-PLEIADES-CARTE-MERE_P06_POWER2.SCHDOC, bottom left]
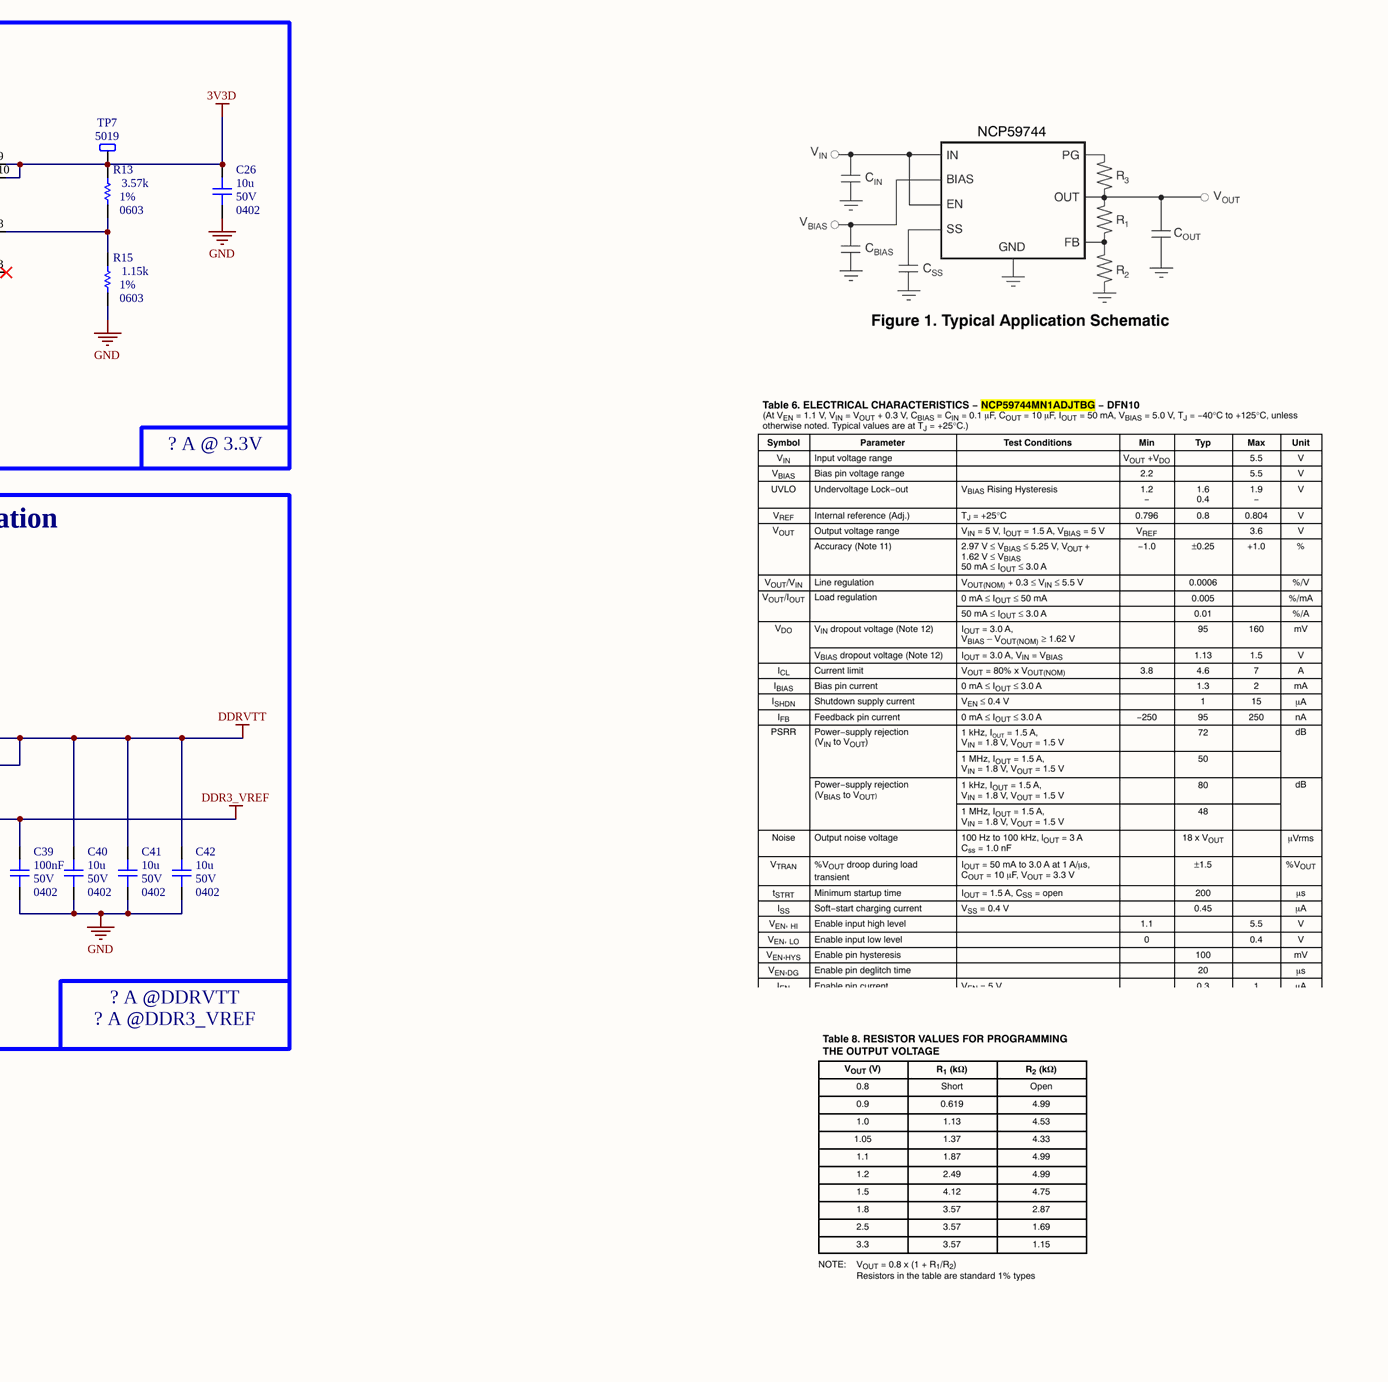
[diagram p6: S7CAS-PLEIADES-CARTE-MERE_P06_POWER2.SCHDOC, bottom right]

### Parts
C19  value 10u  Voltage: 50V  Package: 0402  [CAP_0402]  (hidden comment: CAP - 0402)
C20  value 47u  Voltage: 50V  Package: 0402  [CAP_0402]  (hidden comment: CAP - 0402)
C21  value 1u  Voltage: 50V  Package: 0402  [CAP_0402]  (hidden comment: CAP - 0402)
C22  value 10u  Voltage: 50V  Package: 0402  [CAP_0402]  (hidden comment: CAP - 0402)
C23  value 10n  Voltage: 50V  Package: 0402  [CAP_0402]  (hidden comment: CAP - 0402)
C24  value 47u  Voltage: 50V  Package: 0402  [CAP_0402]  (hidden comment: CAP - 0402)
C25  value 0.1u  Voltage: 50V  Package: 0402  [CAP_0402]  (hidden comment: CAP - 0402)
C26  value 10u  Voltage: 50V  Package: 0402  [CAP_0402]  (hidden comment: CAP - 0402)
C27  value 1u  Voltage: 50V  Package: 0402  [CAP_0402]  (hidden comment: CAP - 0402)
C28  value 0.01u  Voltage: 50V  Package: 0402  [CAP_0402]  (hidden comment: CAP - 0402)
C29  value 10u  Voltage: 50V  Package: 0402  [CAP_0402]  (hidden comment: CAP - 0402)
C30  value 10u  Voltage: 50V  Package: 0402  [CAP_0402]  (hidden comment: CAP - 0402)
C31  value 4.7uF  Voltage: 50V  Package: 0402  [CAP_0402]  (hidden comment: CAP - 0402)
C32  value 0.1u  Voltage: 50V  Package: 0402  [CAP_0402]  (hidden comment: CAP - 0402)
C33  value 10u  Voltage: 50V  Package: 0402  [CAP_0402]  (hidden comment: CAP - 0402)
C34  value 0.1u  Voltage: 50V  Package: 0402  [CAP_0402]  (hidden comment: CAP - 0402)
C35  value 10u  Voltage: 50V  Package: 0402  [CAP_0402]  (hidden comment: CAP - 0402)
C36  value 0.01u  Voltage: 50V  Package: 0402  [CAP_0402]  (hidden comment: CAP - 0402)
C37  value 0.01u  Voltage: 50V  Package: 0402  [CAP_0402]  (hidden comment: CAP - 0402)
C38  value 1n  Voltage: 50V  Package: 0402  [CAP_0402]  (hidden comment: CAP - 0402)
C39  value 100nF  Voltage: 50V  Package: 0402  [CAP_0402]  (hidden comment: CAP - 0402)
C40  value 10u  Voltage: 50V  Package: 0402  [CAP_0402]  (hidden comment: CAP - 0402)
C41  value 10u  Voltage: 50V  Package: 0402  [CAP_0402]  (hidden comment: CAP - 0402)
C42  value 10u  Voltage: 50V  Package: 0402  [CAP_0402]  (hidden comment: CAP - 0402)
C43  value 0.1u  Voltage: 50V  Package: 0402  [CAP_0402]  (hidden comment: CAP - 0402)
C44  value 10u  Voltage: 50V  Package: 0402  [CAP_0402]  (hidden comment: CAP - 0402)
C45  value 0.1u  Voltage: 50V  Package: 0402  [CAP_0402]  (hidden comment: CAP - 0402)
C46  value 10u  Voltage: 50V  Package: 0402  [CAP_0402]  (hidden comment: CAP - 0402)
C47  value 0.01u  Voltage: 50V  Package: 0402  [CAP_0402]  (hidden comment: CAP - 0402)
C48  value 0.01u  Voltage: 50V  Package: 0402  [CAP_0402]  (hidden comment: CAP - 0402)
R12  value 332k  Package: 0603  Precision: 1%  [RES_0603]  (hidden comment: RES - 0603)
R13  value 3.57k  Package: 0603  Precision: 1%  [RES_0603]  (hidden comment: RES - 0603)
R14  value 102k  Package: 0603  Precision: 1%  [RES_0603]  (hidden comment: RES - 0603)
R15  value 1.15k  Package: 0603  Precision: 1%  [RES_0603]  (hidden comment: RES - 0603)
R16  value 10k  Package: 0603  Precision: 1%  [RES_0603]  (hidden comment: RES - 0603)
R17  value 3.57k  Package: 0603  Precision: 1%  [RES_0603]  (hidden comment: RES - 0603)
R18  value 3.57k  Package: 0603  Precision: 1%  [RES_0603]  (hidden comment: RES - 0603)
R19  value 1.15k  Package: 0603  Precision: 1%  [RES_0603]  (hidden comment: RES - 0603)
R20  value 1.15k  Package: 0603  Precision: 1%  [RES_0603]  (hidden comment: RES - 0603)
R21  value 10k  Package: 0603  Precision: 1%  [RES_0603]  (hidden comment: RES - 0603)
R22  value 10k  Package: 0603  Precision: 1%  [RES_0603]  (hidden comment: RES - 0603)
R23  value 4.12k  Package: 0603  Precision: 1%  [RES_0603]  (hidden comment: RES - 0603)
R24  value 3.57k  Package: 0603  Precision: 1%  [RES_0603]  (hidden comment: RES - 0603)
R25  value 4.75k  Package: 0603  Precision: 1%  [RES_0603]  (hidden comment: RES - 0603)
R26  value 2.87K  Package: 0603  Precision: 1%  [RES_0603]  (hidden comment: RES - 0603)
TP5  5019  [TPO_SMD_5019]
TP6  5019  [TPO_SMD_5019]
TP7  5019  [TPO_SMD_5019]
TP8  5019  [TPO_SMD_5019]
TP9  5019  [TPO_SMD_5019]
TP10  5019  [TPO_SMD_5019]
TP11  5019  [TPO_SMD_5019]
U5  TPS7A4701RGWR  [REG_TPS7A4701RGWR]
U6  TPS7A3301RGWR  [REG_LDO_TPS7A3301RGWR]
U7  NCP59744MN1ADJTBG  [REG_LDO_NCP59744MN1ADJTBG]
U8  NCP59744MN1ADJTBG  [REG_LDO_NCP59744MN1ADJTBG]
U9  NCP59744MN1ADJTBG  [REG_LDO_NCP59744MN1ADJTBG]
U10  TPS51200DRCT  [REG_PMIC_TPS51200DRCT]
U11  NCP59744MN1ADJTBG  [REG_LDO_NCP59744MN1ADJTBG]
U12  NCP59744MN1ADJTBG  [REG_LDO_NCP59744MN1ADJTBG]

### Blocks framed on the sheet
5V Generation: C19-C21 TP5 U5
-5V Generation: C22-C24 C27 R12 R14 TP6 U6
3V3D Generation: C25 C26 C28 R13 R15 TP7 U7
3V3FLASH Generation: C32 C33 C36 R16 R17 R19 TP8 U8
3V3A Generation: C34 C35 C37 R18 R20 TP9 U9
VTTDDR and VREF (0.75V) Generation: C29-C31 C38-C42 R21 R22 U10
1V5D Generation: C43 C44 C47 R23 R25 TP10 U11
1V8D Generation: C45 C46 C48 R24 R26 TP11 U12

### Nets
1V5D: C29.2 C30.2 C44.2 R21.2 R23.2 TP10.1 U10.2(VLDOIN) U11.9(OUT) U11.10(OUT)
1V8D: C46.2 R24.2 TP11.1 U12.9(OUT) U12.10(OUT)
3V3A: C35.2 R18.2 TP9.1 U9.9(OUT) U9.10(OUT)
3V3D: C26.2 C31.2 R13.2 TP7.1 U7.9(OUT) U7.10(OUT) U10.10(VIN)
3V3FLASH: C33.2 R16.2 R17.2 TP8.1 U8.9(OUT) U8.10(OUT)
3V6: C25.2 C32.2 C34.2 C43.2 C45.2 U7.1(IN) U7.2(IN) U7.4(BIAS) U8.1(IN) U8.2(IN) U8.4(BIAS) U8.5(EN) U9.1(IN) U9.2(IN) U9.4(BIAS) U11.1(IN) U11.2(IN) U11.4(BIAS) U12.1(IN) U12.2(IN) U12.4(BIAS)
5V: C20.2 TP5.1 U5.1(OUT) U5.3(SENSE/FB) U5.20(OUT)
5V8: C19.2 U5.15(IN) U5.16(IN)
-5V: C23.2 C24.2 R12.2 TP6.1 U6.1(OUT) U6.20(OUT)
-5V5: C22.2 U6.15(IN) U6.16(IN)
DDR3_VREF: C39.2 U10.6(REFOUT)
DDRVTT: C40.2 C41.2 C42.2 U10.3(VO) U10.5(VOSNS)
GND: C19.1 C20.1 C21.1 C22.1 C24.1 C25.1 C26.1 C27.1 C28.1 C29.1 C30.1 C31.1 C32.1 C33.1 C34.1 C35.1 C36.1 C37.1 C38.1 C39.1 C40.1 C41.1 C42.1 C43.1 C44.1 C45.1 C46.1 C47.1 C48.1 R14.1 R15.1 R19.1 R20.1 R22.1 R25.1 R26.1 U5.6(3P2V) U5.7(GND) U5.10(0P4V) U5.E1(PAD) U6.7(GND) U6.21(EP) U7.6(GND) U7.11(PAD) U8.6(GND) U8.11(PAD) U9.6(GND) U9.11(PAD) U10.4(PGND) U10.8(GND) U10.11(EP) U11.6(GND) U11.11(PAD) U12.6(GND) U12.11(PAD)
ENABLE: R16.1 U5.13(EN) U6.13(EN) U7.5(EN) U8.3(PG) U9.5(EN) U10.7(EN) U11.5(EN) U12.5(EN)
NetC21_2: C21.2 U5.14(NR)
NetC23_1: C23.1 R12.1 R14.2 U6.3(FB)
NetC27_2: C27.2 U6.14(NR/SS)
NetC28_2: C28.2 U7.7(SS)
NetC36_2: C36.2 U8.7(SS)
NetC37_2: C37.2 U9.7(SS)
NetC38_2: C38.2 R21.1 R22.2 U10.1(REFIN)
NetC47_2: C47.2 U11.7(SS)
NetC48_2: C48.2 U12.7(SS)
NetR13_1: R13.1 R15.2 U7.8(FB)
NetR17_1: R17.1 R19.2 U8.8(FB)
NetR18_1: R18.1 R20.2 U9.8(FB)
NetR23_1: R23.1 R25.2 U11.8(FB)
NetR24_1: R24.1 R26.2 U12.8(FB)

Not connected (* = marked no-connect by the designer): U5 2(NC)* 4(6P4V2)* 5(6P4V1)* 8(1P6V)* 9(0P8V)* 11(0P2V)* 12(0P1V)* 17(NC)* 18(NC)* 19(NC)*; U6 2(NC)* 4(NC)* 5(NC)* 6(NC)* 8(NC)* 9(NC)* 10(NC)* 11(NC)* 12(NC)* 17(NC)* 18(NC)* 19(NC)*; U7 3(PG)*; U9 3(PG)*; U10 9(PGOOD)*; U11 3(PG)*; U12 3(PG)*

### Notes on the sheet
- 0.056 A @ 5.81V
- 0.056 A @ 5V
- 0.056 A @ -5.5V
- 0.056 A @ -5V
- ? A @ 3.6V
- ? A @ 3.3V
- 0.025 A @ 3.6V
- 0.025 A @ 3.3V
- 0.585 A @ 3.6V
- 0.585 A @ 3.3V
- ? A @ 3.3V
  ? A @ 1.5V
- ? A @DDRVTT
  ? A @DDR3_VREF
- 0.482 A @ 3.6V
- 0.482 A @ 1.5V
- 0.566 A @ 3.6V
- 0.566 A @ 1.8V
- Sheet Name
- Project Title
- Global Project
- Size
- Group
- Revision
- Date
- Sheet
- of
- Filename
- Designers
- (in symbol REG_LDO_NCP59744MN1ADJTBG) LDO
- (in symbol REG_LDO_TPS7A3301RGWR) LDO

### Library data of the parts
C19-C48 = CAP - 0402: Precision: 10%; Current: *; CreatedBy: Jonathan Bouchard; Power: *
TP5-TP11 = TPO_SMD_5019: as TP1 on sheet S7CAS-PLEIADES-CARTE-MERE_P06_POWER1; Current Rating: *; Manufacturer #2: *; Note: *; Power Max: *; Part Number #2: *; HelpURL: https://www.digikey.ca/product-detail/en/keystone-electronics/5019/36-5019CT-ND/3907344; Supplier 1: Digi-Key; Supplier Part Number 1: 36-5019CT-ND; Assembly Type: SMD; Part Number #1: 5019; Package: SMD; CreatedBy/Date: Olivier Bernard / 5/12/2017; Temperature: *; Tolerance: *; VerifiedBy: Caroline Paulin / 5 juillet 2018; Voltage Rating: *; Cryo: UNKNOWN
U5 = REG_LDO_TPS7A4701RGWR: REG - LINEAR POS ADJ 1A - 20VQFN; Manufacturer #1: Texas Instruments; GRAMS Lib Spec: 2.8; Magnetic Material: Unknown; Polarized: Yes; Value: 1.4 à 34V; Voltage rating: 35V max; Assembly Type: SMD; CreatedBy/Date: L-P Gauthier / 2018-05-29; Current Rating: 1A; Manufacturer #2: TBD; Part Number #1: TPS7A4701RGWR; Part Number #2: TBD; Package: 20-VQFN Exposed Pad; Power Max: *; Tolerance: -; Supplier 1: Digi-Key; Supplier Part Number 1: 296-37224-1-ND; VerifiedBy: Caroline Paulin - 28 sept 2018; Temperature: -40°C ~ 125°C; HelpURL: http://www.ti.com/lit/ds/symlink/tps7a47.pdf; Cryo: UNKNOWN
U6 = REG_LDO_TPS7A3301RGWR: REG - LDO Negative Adjustable 1 Output -1.18V-33V 1A -  20-VQFN (5x5); Manufacturer #1: Texas Instruments; Value: -1.18V~-33V; Voltage Rating: -36V; GRAMS Lib Spec: 2.8; Magnetic Material: Unknown; Polarized: Yes; Tolerance: *; Current Rating: 1A; Power Max: *; HelpURL: http://www.ti.com/lit/ds/symlink/tps7a33.pdf; CreatedBy/Date: Keven Deslandes - 2018/10/11; VerifiedBy: Caroline Paulin - 11/12/2018; Temperature: -40°C ~ 125°C; Package: 20-VQFN; Manufacturer #2: *; Assembly Type: SMD; Part Number #2: *; Part Number #1: TPS7A3301RGWR; Supplier 1: Digi-Key; Supplier Part Number 1: 296-39502-1-ND; Cryo: UNKNOWN
U7-U9 U11 U12 = REG_LDO_NCP59744MN1ADJTBG: REG - LINEAR POS ADJ 3A BIAS - 10-VFDFN; Manufacturer #1: ON Semiconductor; Value: 0.8V ~ 3.6V; Voltage Rating: (Vout+VDO) ~ 5.5V; Power Max: 10.8W; GRAMS Lib Spec: 2.8; Magnetic Material: Unknown; Polarized: Yes; Tolerance: -; Current Rating: 3A; HelpURL: https://www.onsemi.com/pub/Collateral/NCP59744-D.PDF; CreatedBy/Date: Raphael Bouchard / 2019-06-07; VerifiedBy: C.Paulin - 13/06/2019; Temperature: -40°C ~ 125°C (TJ); Package: 10-VFDFN; Manufacturer #2: -; Note: -; Assembly Type: SMD; Part Number #2: -; Part Number #1: NCP59744MN1ADJTBG; Supplier 1: Digi-Key; Supplier Part Number 1: NCP59744MN1ADJTBGOSCT-ND; Cryo: UNKNOWN
U10 = REG_PMIC_TPS51200DRCT: REG - DDR TERMINATION/REF REG - 10-VFDFN; Manufacturer #1: Texas Instruments; Value: DDR, DDR2, DDR3(L), DDR4; Voltage Rating: 2.375V ~ 3.5V; Current Rating: Source: 3A~4.5A, Sink: 3.5A~5.5A; GRAMS Lib Spec: 2.8; Magnetic Material: Unknown; Polarized: Yes; Tolerance: *; Power Max: *; HelpURL: http://www.ti.com/lit/ds/symlink/tps51200.pdf; CreatedBy/Date: Joel Lemay 2019-03-19; VerifiedBy: Nicolas V. (2019-05-31); Temperature: -40°C ~ 85°C; Package: 10-VFDFN; Manufacturer #2: *; Note: *; Assembly Type: SMD; Part Number #2: *; Part Number #1: TPS51200DRCT; Supplier 1: Digi-Key; Supplier Part Number 1: 296-23830-1-ND; Cryo: UNKNOWN
R12-R26 = RES - 0603: Current: *; CreatedBy: Jonathan Bouchard

## Sheet S7CAS-PLEIADES-CARTE-MERE_P06_FPGA1.SCHDOC
size Tabloid; SheetNumber: 6; SheetTotal: 18; Sheet_Name: FPGA1; Size: 11x17
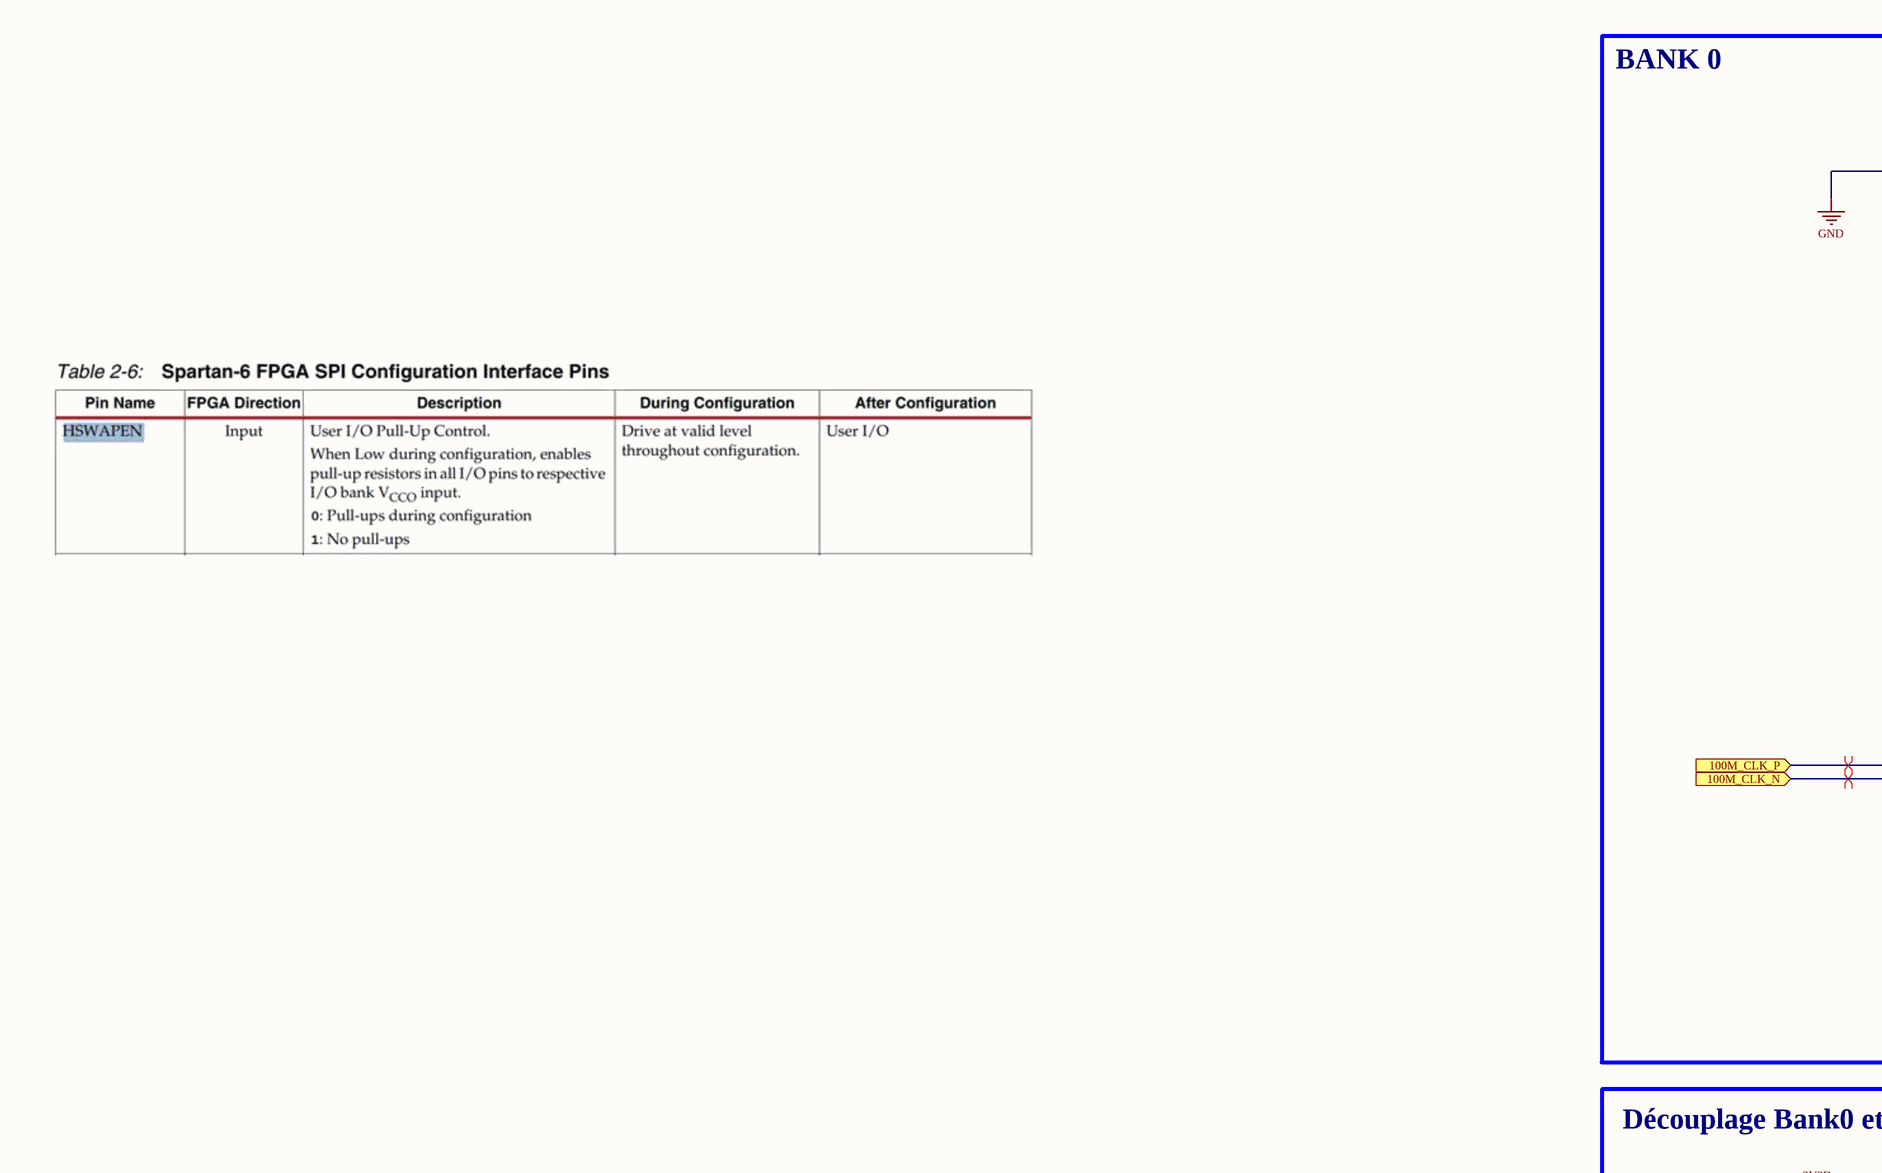
[diagram p7: S7CAS-PLEIADES-CARTE-MERE_P06_FPGA1.SCHDOC, top left]
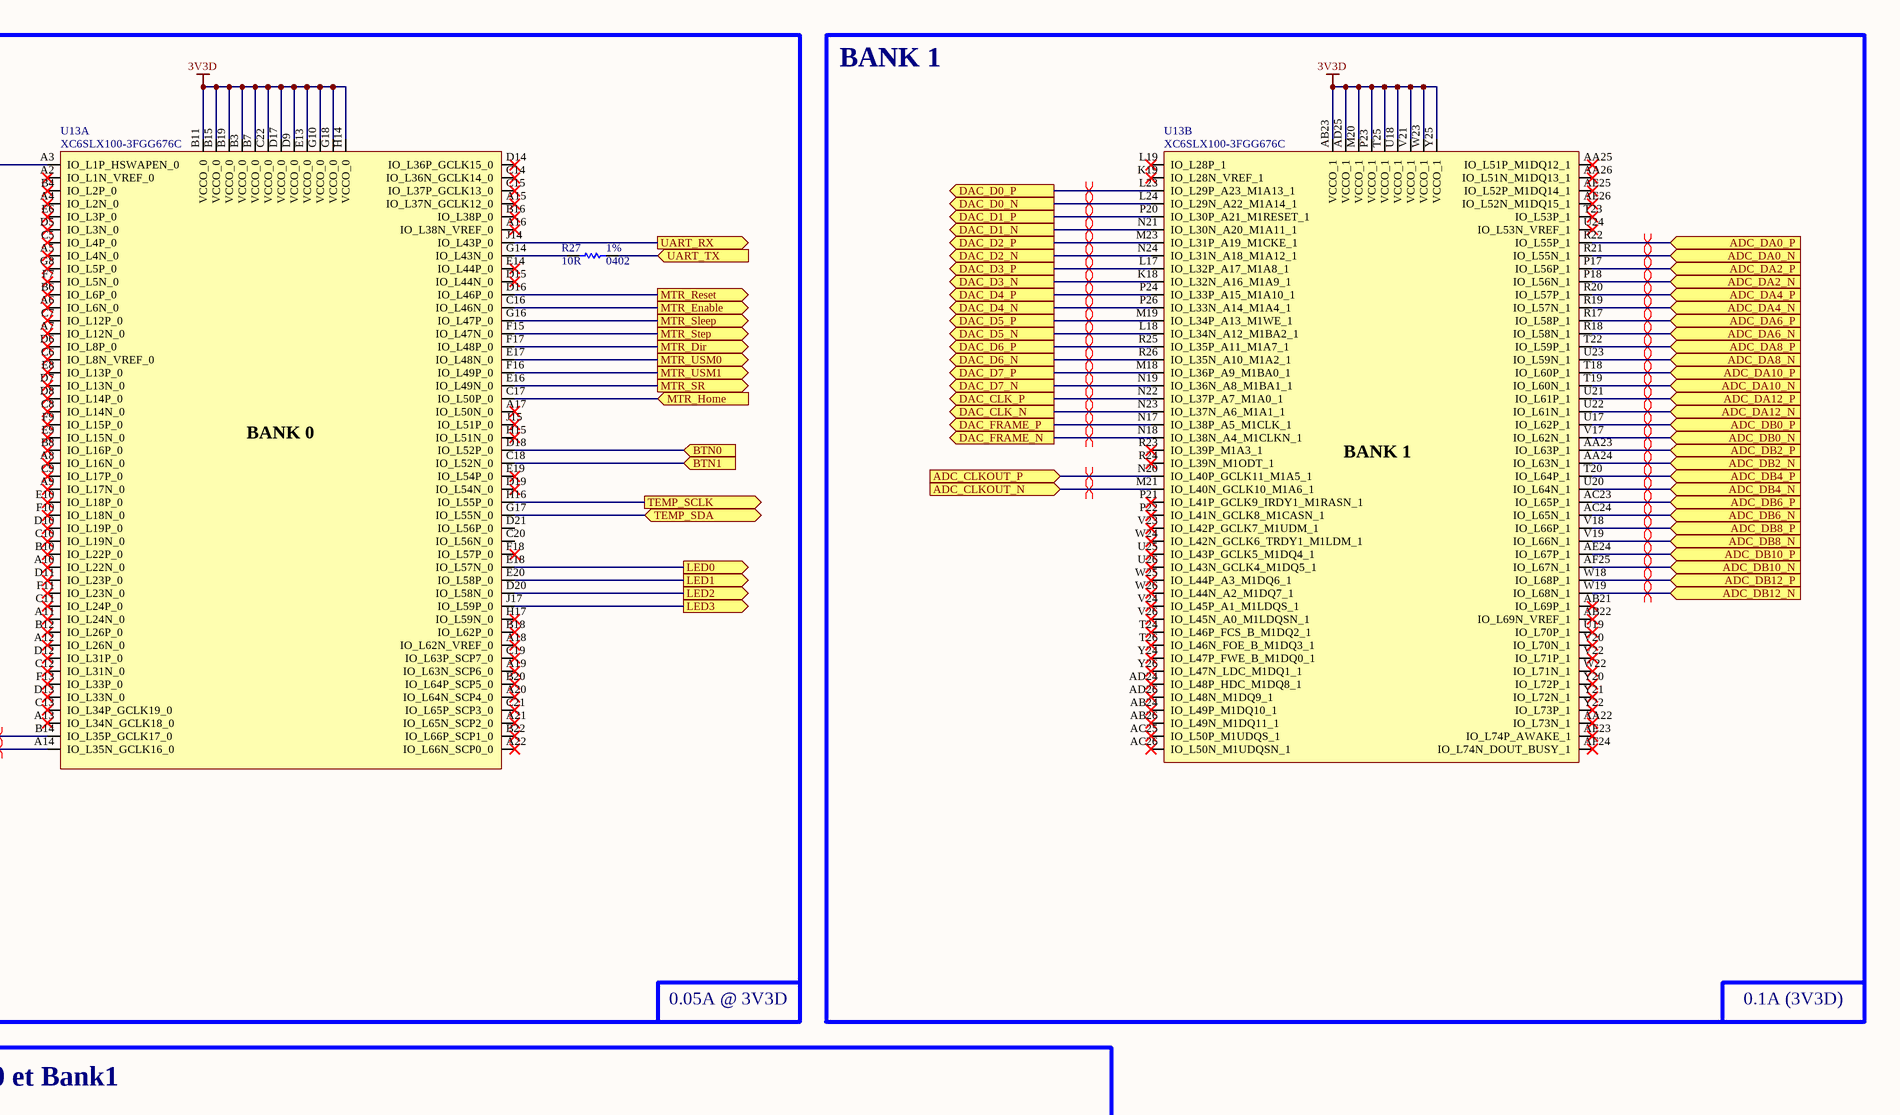
[diagram p8: S7CAS-PLEIADES-CARTE-MERE_P06_FPGA1.SCHDOC, top right]
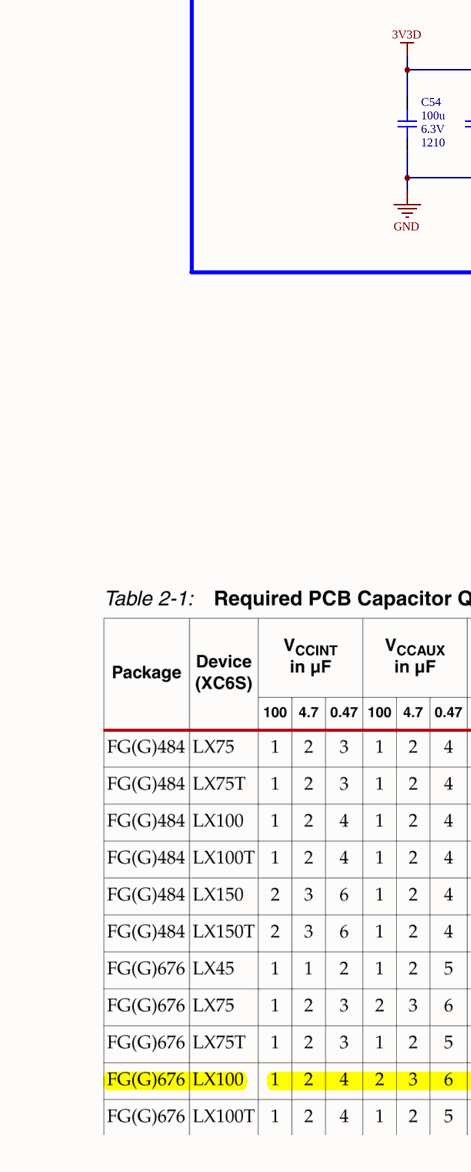
[diagram p9: S7CAS-PLEIADES-CARTE-MERE_P06_FPGA1.SCHDOC, bottom left]
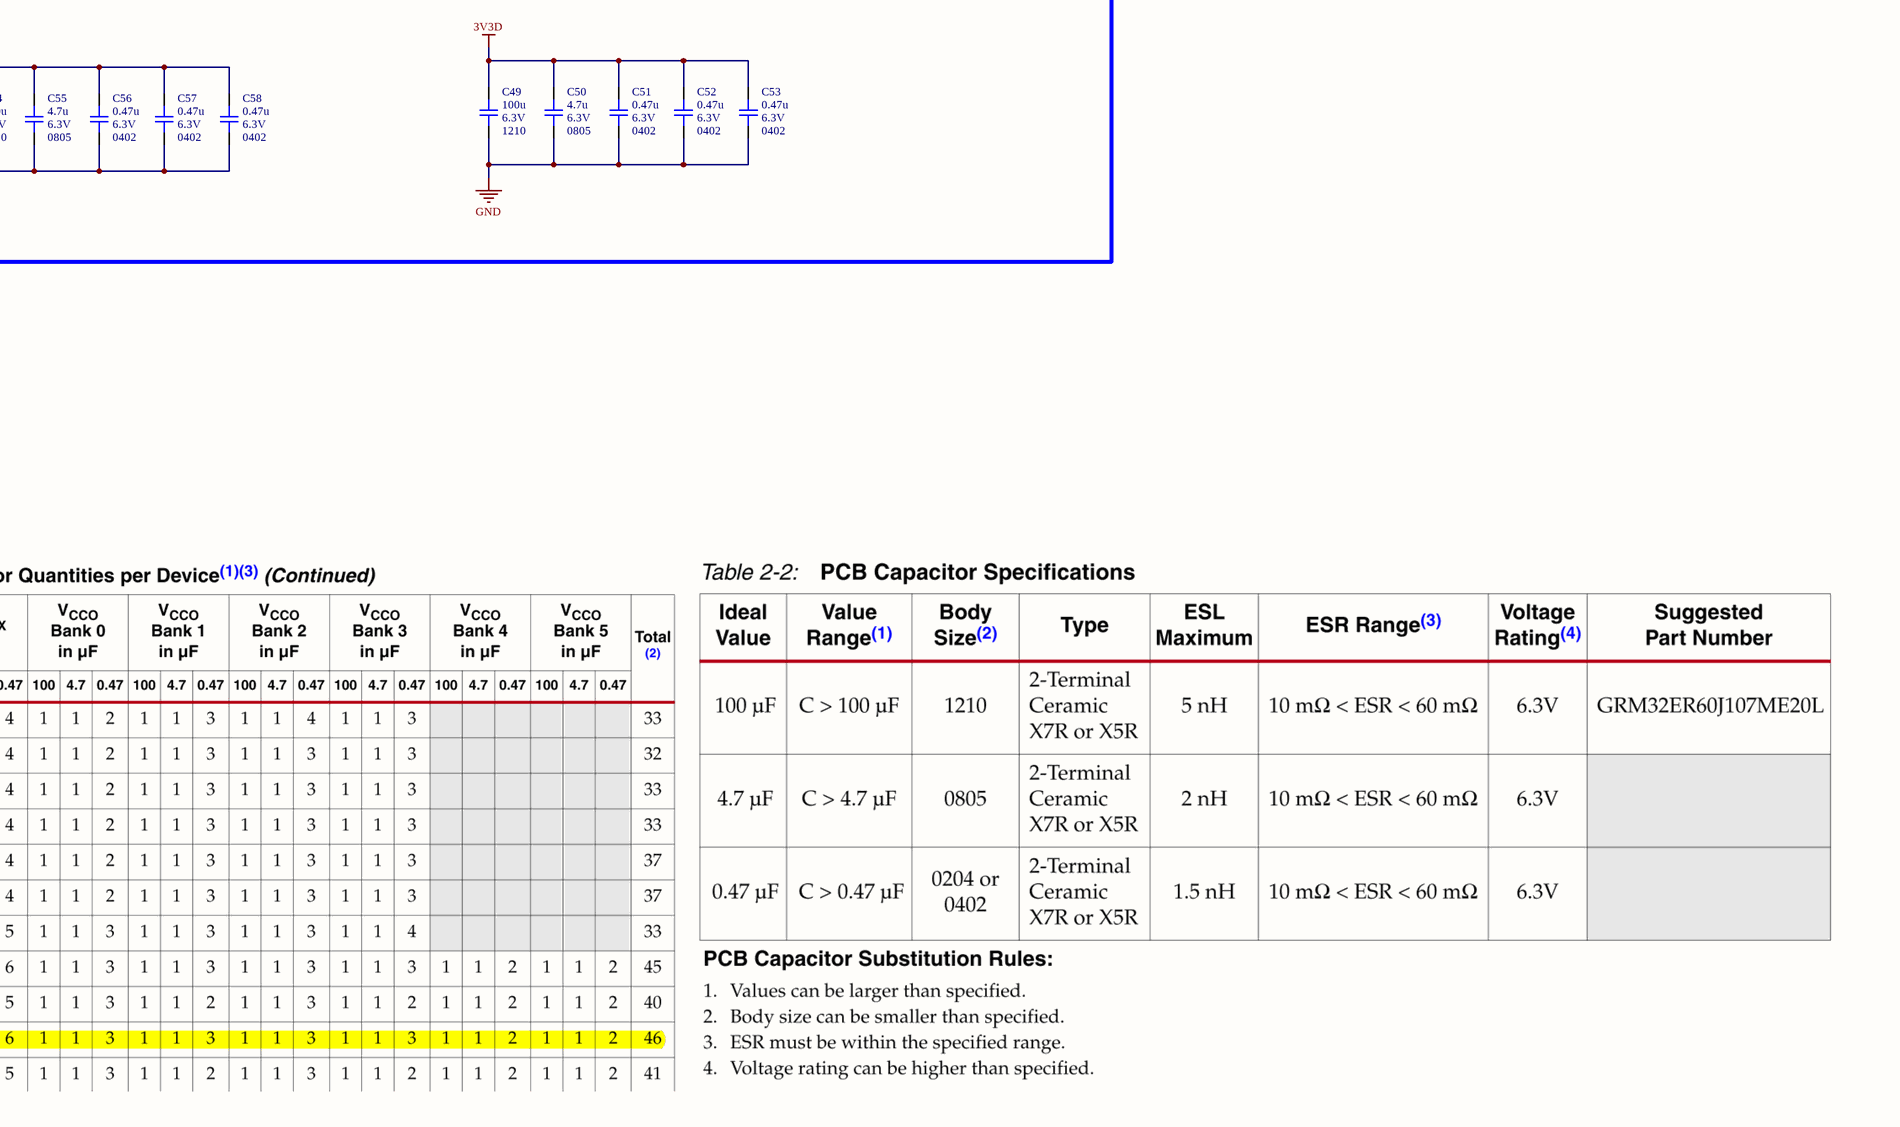
[diagram p10: S7CAS-PLEIADES-CARTE-MERE_P06_FPGA1.SCHDOC, bottom right]

### Parts
C49  value 100u  Voltage: 6.3V  Package: 1210  [CAP_1210]  (hidden comment: CAP - 1210)
C50  value 4.7u  Voltage: 6.3V  Package: 0805  [CAP_0805]  (hidden comment: CAP - 0805)
C51  value 0.47u  Voltage: 6.3V  Package: 0402  [CAP_0402]  (hidden comment: CAP - 0402)
C52  value 0.47u  Voltage: 6.3V  Package: 0402  [CAP_0402]  (hidden comment: CAP - 0402)
C53  value 0.47u  Voltage: 6.3V  Package: 0402  [CAP_0402]  (hidden comment: CAP - 0402)
C54  value 100u  Voltage: 6.3V  Package: 1210  [CAP_1210]  (hidden comment: CAP - 1210)
C55  value 4.7u  Voltage: 6.3V  Package: 0805  [CAP_0805]  (hidden comment: CAP - 0805)
C56  value 0.47u  Voltage: 6.3V  Package: 0402  [CAP_0402]  (hidden comment: CAP - 0402)
C57  value 0.47u  Voltage: 6.3V  Package: 0402  [CAP_0402]  (hidden comment: CAP - 0402)
C58  value 0.47u  Voltage: 6.3V  Package: 0402  [CAP_0402]  (hidden comment: CAP - 0402)
R27  value 10R  Tolerance: 1%  Package: 0402  [RES_0402]  (hidden comment: RMCF0402FT10R0)
U13  XC6SLX100-3FGG676C  [FPGA_XILINX_FGG676]  (parts A,B of 10)

### Blocks framed on the sheet
BANK 0: R27 U13
BANK 1: U13
Découplage Bank0 et Bank1: C49-C58

### Ports
100M_CLK_N (in, see S7CAS-PLEIADES-CARTE-MERE_P06_CLOCK[4A]), 100M_CLK_P (in, see S7CAS-PLEIADES-CARTE-MERE_P06_CLOCK[4A]), ADC_CLKOUT_N (in, see S7CAS-PLEIADES-CARTE-MERE_P06_ADC[6A]), ADC_CLKOUT_P (in, see S7CAS-PLEIADES-CARTE-MERE_P06_ADC[6A]), ADC_DA0_N (in, see S7CAS-PLEIADES-CARTE-MERE_P06_ADC[4A]), ADC_DA0_P (in, see S7CAS-PLEIADES-CARTE-MERE_P06_ADC[4A]), ADC_DA2_N (in, see S7CAS-PLEIADES-CARTE-MERE_P06_ADC[4A]), ADC_DA2_P (in, see S7CAS-PLEIADES-CARTE-MERE_P06_ADC[4A]), ADC_DA4_N (in, see S7CAS-PLEIADES-CARTE-MERE_P06_ADC[4A]), ADC_DA4_P (in, see S7CAS-PLEIADES-CARTE-MERE_P06_ADC[4A]), ADC_DA6_N (in, see S7CAS-PLEIADES-CARTE-MERE_P06_ADC[4A]), ADC_DA6_P (in, see S7CAS-PLEIADES-CARTE-MERE_P06_ADC[4A]), ADC_DA8_N (in, see S7CAS-PLEIADES-CARTE-MERE_P06_ADC[4A]), ADC_DA8_P (in, see S7CAS-PLEIADES-CARTE-MERE_P06_ADC[4A]), ADC_DA10_N (in, see S7CAS-PLEIADES-CARTE-MERE_P06_ADC[4A]), ADC_DA10_P (in, see S7CAS-PLEIADES-CARTE-MERE_P06_ADC[4A]), ADC_DA12_N (in, see S7CAS-PLEIADES-CARTE-MERE_P06_ADC[4B]), ADC_DA12_P (in, see S7CAS-PLEIADES-CARTE-MERE_P06_ADC[4B]), ADC_DB0_N (in, see S7CAS-PLEIADES-CARTE-MERE_P06_ADC[4B]), ADC_DB0_P (in, see S7CAS-PLEIADES-CARTE-MERE_P06_ADC[4B]), ADC_DB2_N (in, see S7CAS-PLEIADES-CARTE-MERE_P06_ADC[4B]), ADC_DB2_P (in, see S7CAS-PLEIADES-CARTE-MERE_P06_ADC[4B]), ADC_DB4_N (in, see S7CAS-PLEIADES-CARTE-MERE_P06_ADC[4B]), ADC_DB4_P (in, see S7CAS-PLEIADES-CARTE-MERE_P06_ADC[4B]), ADC_DB6_N (in, see S7CAS-PLEIADES-CARTE-MERE_P06_ADC[4B]), ADC_DB6_P (in, see S7CAS-PLEIADES-CARTE-MERE_P06_ADC[4B]), ADC_DB8_N (in, see S7CAS-PLEIADES-CARTE-MERE_P06_ADC[4B]), ADC_DB8_P (in, see S7CAS-PLEIADES-CARTE-MERE_P06_ADC[4B]), ADC_DB10_N (in, see S7CAS-PLEIADES-CARTE-MERE_P06_ADC[4C]), ADC_DB10_P (in, see S7CAS-PLEIADES-CARTE-MERE_P06_ADC[4B]), ADC_DB12_N (in, see S7CAS-PLEIADES-CARTE-MERE_P06_ADC[4C]), ADC_DB12_P (in, see S7CAS-PLEIADES-CARTE-MERE_P06_ADC[4C]), BTN0 (in, see S7CAS-PLEIADES-CARTE-MERE_P06_MISC[1A]), BTN1 (in, see S7CAS-PLEIADES-CARTE-MERE_P06_MISC[1B]), DAC_CLK_N (out, see S7CAS-PLEIADES-CARTE-MERE_P06_DAC[1B]), DAC_CLK_P (out, see S7CAS-PLEIADES-CARTE-MERE_P06_DAC[1B]), DAC_D0_N (out, see S7CAS-PLEIADES-CARTE-MERE_P06_DAC[1A]), DAC_D0_P (out, see S7CAS-PLEIADES-CARTE-MERE_P06_DAC[1A]), DAC_D1_N (out, see S7CAS-PLEIADES-CARTE-MERE_P06_DAC[1B]), DAC_D1_P (out, see S7CAS-PLEIADES-CARTE-MERE_P06_DAC[1B]), DAC_D2_N (out, see S7CAS-PLEIADES-CARTE-MERE_P06_DAC[1B]), DAC_D2_P (out, see S7CAS-PLEIADES-CARTE-MERE_P06_DAC[1B]), DAC_D3_N (out, see S7CAS-PLEIADES-CARTE-MERE_P06_DAC[1B]), DAC_D3_P (out, see S7CAS-PLEIADES-CARTE-MERE_P06_DAC[1B]), DAC_D4_N (out, see S7CAS-PLEIADES-CARTE-MERE_P06_DAC[1B]), DAC_D4_P (out, see S7CAS-PLEIADES-CARTE-MERE_P06_DAC[1B]), DAC_D5_N (out, see S7CAS-PLEIADES-CARTE-MERE_P06_DAC[1B]), DAC_D5_P (out, see S7CAS-PLEIADES-CARTE-MERE_P06_DAC[1B]), DAC_D6_N (out, see S7CAS-PLEIADES-CARTE-MERE_P06_DAC[1B]), DAC_D6_P (out, see S7CAS-PLEIADES-CARTE-MERE_P06_DAC[1B]), DAC_D7_N (out, see S7CAS-PLEIADES-CARTE-MERE_P06_DAC[1B]), DAC_D7_P (out, see S7CAS-PLEIADES-CARTE-MERE_P06_DAC[1B]), DAC_FRAME_N (out, see S7CAS-PLEIADES-CARTE-MERE_P06_DAC[1B]), DAC_FRAME_P (out, see S7CAS-PLEIADES-CARTE-MERE_P06_DAC[1B]), LED0 (out, see S7CAS-PLEIADES-CARTE-MERE_P06_MISC[2B]), LED1 (out, see S7CAS-PLEIADES-CARTE-MERE_P06_MISC[3B]), LED2 (out, see S7CAS-PLEIADES-CARTE-MERE_P06_MISC[3B]), LED3 (out, see S7CAS-PLEIADES-CARTE-MERE_P06_MISC[4B]), MTR_Dir (out, see S7CAS-PLEIADES-CARTE-MERE_P06_MOTOR[2B]), MTR_Enable (out, see S7CAS-PLEIADES-CARTE-MERE_P06_MOTOR[2B]), MTR_Home (in, see S7CAS-PLEIADES-CARTE-MERE_P06_MOTOR[2B]), MTR_Reset (out, see S7CAS-PLEIADES-CARTE-MERE_P06_MOTOR[2A]), MTR_Sleep (out, see S7CAS-PLEIADES-CARTE-MERE_P06_MOTOR[2B]), MTR_SR (out, see S7CAS-PLEIADES-CARTE-MERE_P06_MOTOR[2B]), MTR_Step (out, see S7CAS-PLEIADES-CARTE-MERE_P06_MOTOR[2B]), MTR_USM0 (out, see S7CAS-PLEIADES-CARTE-MERE_P06_MOTOR[2B]), MTR_USM1 (out, see S7CAS-PLEIADES-CARTE-MERE_P06_MOTOR[2B]), TEMP_SCLK (out, see S7CAS-PLEIADES-CARTE-MERE_P06_MISC[6A]), TEMP_SDA (bidir, see S7CAS-PLEIADES-CARTE-MERE_P06_MISC[6A]), UART_RX (out, see S7CAS-PLEIADES-CARTE-MERE_P06_USB_PROGRAMER[6B]), UART_TX (in, see S7CAS-PLEIADES-CARTE-MERE_P06_USB_PROGRAMER[6B])

### Nets
3V3D: C49.2 C50.2 C51.2 C52.2 C53.2 C54.2 C55.2 C56.2 C57.2 C58.2 U13.AB23(VCCO_1) U13.AD25(VCCO_1) U13.B3(VCCO_0) U13.B7(VCCO_0) U13.B11(VCCO_0) U13.B15(VCCO_0) U13.B19(VCCO_0) U13.C22(VCCO_0) U13.D9(VCCO_0) U13.D17(VCCO_0) U13.E13(VCCO_0) U13.G10(VCCO_0) U13.G18(VCCO_0) U13.H14(VCCO_0) U13.M20(VCCO_1) U13.P23(VCCO_1) U13.T25(VCCO_1) U13.U18(VCCO_1) U13.V21(VCCO_1) U13.W23(VCCO_1) U13.Y25(VCCO_1)
GND: C49.1 C50.1 C51.1 C52.1 C53.1 C54.1 C55.1 C56.1 C57.1 C58.1 U13.A3(IO_L1P_HSWAPEN_0)
100M_CLK_N: U13.A14(IO_L35N_GCLK16_0) ; port 100M_CLK_N
100M_CLK_P: U13.B14(IO_L35P_GCLK17_0) ; port 100M_CLK_P
ADC_CLKOUT_N: U13.M21(IO_L40N_GCLK10_M1A6_1) ; port ADC_CLKOUT_N
ADC_CLKOUT_P: U13.N20(IO_L40P_GCLK11_M1A5_1) ; port ADC_CLKOUT_P
ADC_DA0_N: U13.R21(IO_L55N_1) ; port ADC_DA0_N
ADC_DA0_P: U13.R22(IO_L55P_1) ; port ADC_DA0_P
ADC_DA2_N: U13.P18(IO_L56N_1) ; port ADC_DA2_N
ADC_DA2_P: U13.P17(IO_L56P_1) ; port ADC_DA2_P
ADC_DA4_N: U13.R19(IO_L57N_1) ; port ADC_DA4_N
ADC_DA4_P: U13.R20(IO_L57P_1) ; port ADC_DA4_P
ADC_DA6_N: U13.R18(IO_L58N_1) ; port ADC_DA6_N
ADC_DA6_P: U13.R17(IO_L58P_1) ; port ADC_DA6_P
ADC_DA8_N: U13.U23(IO_L59N_1) ; port ADC_DA8_N
ADC_DA8_P: U13.T22(IO_L59P_1) ; port ADC_DA8_P
ADC_DA10_N: U13.T19(IO_L60N_1) ; port ADC_DA10_N
ADC_DA10_P: U13.T18(IO_L60P_1) ; port ADC_DA10_P
ADC_DA12_N: U13.U22(IO_L61N_1) ; port ADC_DA12_N
ADC_DA12_P: U13.U21(IO_L61P_1) ; port ADC_DA12_P
ADC_DB0_N: U13.V17(IO_L62N_1) ; port ADC_DB0_N
ADC_DB0_P: U13.U17(IO_L62P_1) ; port ADC_DB0_P
ADC_DB2_N: U13.AA24(IO_L63N_1) ; port ADC_DB2_N
ADC_DB2_P: U13.AA23(IO_L63P_1) ; port ADC_DB2_P
ADC_DB4_N: U13.U20(IO_L64N_1) ; port ADC_DB4_N
ADC_DB4_P: U13.T20(IO_L64P_1) ; port ADC_DB4_P
ADC_DB6_N: U13.AC24(IO_L65N_1) ; port ADC_DB6_N
ADC_DB6_P: U13.AC23(IO_L65P_1) ; port ADC_DB6_P
ADC_DB8_N: U13.V19(IO_L66N_1) ; port ADC_DB8_N
ADC_DB8_P: U13.V18(IO_L66P_1) ; port ADC_DB8_P
ADC_DB10_N: U13.AF25(IO_L67N_1) ; port ADC_DB10_N
ADC_DB10_P: U13.AE24(IO_L67P_1) ; port ADC_DB10_P
ADC_DB12_N: U13.W19(IO_L68N_1) ; port ADC_DB12_N
ADC_DB12_P: U13.W18(IO_L68P_1) ; port ADC_DB12_P
BTN0: U13.D18(IO_L52P_0) ; port BTN0
BTN1: U13.C18(IO_L52N_0) ; port BTN1
DAC_CLK_N: U13.N23(IO_L37N_A6_M1A1_1) ; port DAC_CLK_N
DAC_CLK_P: U13.N22(IO_L37P_A7_M1A0_1) ; port DAC_CLK_P
DAC_D0_N: U13.L24(IO_L29N_A22_M1A14_1) ; port DAC_D0_N
DAC_D0_P: U13.L23(IO_L29P_A23_M1A13_1) ; port DAC_D0_P
DAC_D1_N: U13.N21(IO_L30N_A20_M1A11_1) ; port DAC_D1_N
DAC_D1_P: U13.P20(IO_L30P_A21_M1RESET_1) ; port DAC_D1_P
DAC_D2_N: U13.N24(IO_L31N_A18_M1A12_1) ; port DAC_D2_N
DAC_D2_P: U13.M23(IO_L31P_A19_M1CKE_1) ; port DAC_D2_P
DAC_D3_N: U13.K18(IO_L32N_A16_M1A9_1) ; port DAC_D3_N
DAC_D3_P: U13.L17(IO_L32P_A17_M1A8_1) ; port DAC_D3_P
DAC_D4_N: U13.P26(IO_L33N_A14_M1A4_1) ; port DAC_D4_N
DAC_D4_P: U13.P24(IO_L33P_A15_M1A10_1) ; port DAC_D4_P
DAC_D5_N: U13.L18(IO_L34N_A12_M1BA2_1) ; port DAC_D5_N
DAC_D5_P: U13.M19(IO_L34P_A13_M1WE_1) ; port DAC_D5_P
DAC_D6_N: U13.R26(IO_L35N_A10_M1A2_1) ; port DAC_D6_N
DAC_D6_P: U13.R25(IO_L35P_A11_M1A7_1) ; port DAC_D6_P
DAC_D7_N: U13.N19(IO_L36N_A8_M1BA1_1) ; port DAC_D7_N
DAC_D7_P: U13.M18(IO_L36P_A9_M1BA0_1) ; port DAC_D7_P
DAC_FRAME_N: U13.N18(IO_L38N_A4_M1CLKN_1) ; port DAC_FRAME_N
DAC_FRAME_P: U13.N17(IO_L38P_A5_M1CLK_1) ; port DAC_FRAME_P
LED0: U13.E18(IO_L57N_0) ; port LED0
LED1: U13.E20(IO_L58P_0) ; port LED1
LED2: U13.D20(IO_L58N_0) ; port LED2
LED3: U13.J17(IO_L59P_0) ; port LED3
MTR_Dir: U13.F17(IO_L48P_0) ; port MTR_Dir
MTR_Enable: U13.C16(IO_L46N_0) ; port MTR_Enable
MTR_Home: U13.C17(IO_L50P_0) ; port MTR_Home
MTR_Reset: U13.D16(IO_L46P_0) ; port MTR_Reset
MTR_Sleep: U13.G16(IO_L47P_0) ; port MTR_Sleep
MTR_SR: U13.E16(IO_L49N_0) ; port MTR_SR
MTR_Step: U13.F15(IO_L47N_0) ; port MTR_Step
MTR_USM0: U13.E17(IO_L48N_0) ; port MTR_USM0
MTR_USM1: U13.F16(IO_L49P_0) ; port MTR_USM1
TEMP_SCLK: U13.H16(IO_L55P_0) ; port TEMP_SCLK
TEMP_SDA: U13.G17(IO_L55N_0) ; port TEMP_SDA
UART_RX: U13.J14(IO_L43P_0) ; port UART_RX
UART_TX: R27.1 ; port UART_TX
NetR27_2: R27.2 U13.G14(IO_L43N_0)

Not connected (* = marked no-connect by the designer): U13 A2(IO_L1N_VREF_0)* A4(IO_L2N_0)* A5(IO_L4N_0)* A6(IO_L6N_0)* A7(IO_L12N_0)* A8(IO_L16N_0)* A9(IO_L17N_0)* A10(IO_L22N_0)* A11(IO_L24N_0)* A12(IO_L26N_0)* A13(IO_L34N_GCLK18_0)* A15(IO_L37N_GCLK12_0)* A16(IO_L38N_VREF_0)* A17(IO_L50N_0)* A18(IO_L62N_VREF_0)* A19(IO_L63N_SCP6_0)* A20(IO_L64N_SCP4_0)* A21(IO_L65N_SCP2_0)* A22(IO_L66N_SCP0_0)* AA22(IO_L73N_1)* AA25(IO_L51P_M1DQ12_1)* AA26(IO_L51N_M1DQ13_1)* AB21(IO_L69P_1)* AB22(IO_L69N_VREF_1)* AB24(IO_L49P_M1DQ10_1)* AB26(IO_L49N_M1DQ11_1)* AC25(IO_L50P_M1UDQS_1)* AC26(IO_L50N_M1UDQSN_1)* AD24(IO_L48P_HDC_M1DQ8_1)* AD26(IO_L48N_M1DQ9_1)* AE23(IO_L74P_AWAKE_1)* AE25(IO_L52P_M1DQ14_1)* AE26(IO_L52N_M1DQ15_1)* AF24(IO_L74N_DOUT_BUSY_1)* B4(IO_L2P_0)* B6(IO_L6P_0)* B8(IO_L16P_0)* B10(IO_L22P_0)* B12(IO_L26P_0)* B16(IO_L38P_0)* B18(IO_L62P_0)* B20(IO_L64P_SCP5_0)* B22(IO_L66P_SCP1_0)* C5(IO_L4P_0)* C6(IO_L8N_VREF_0)* C7(IO_L12P_0)* C8(IO_L14N_0)* C9(IO_L17P_0)* C10(IO_L19N_0)* C11(IO_L24P_0)* C12(IO_L31N_0)* C13(IO_L34P_GCLK19_0)* C14(IO_L36N_GCLK14_0)* C15(IO_L37P_GCLK13_0)* C19(IO_L63P_SCP7_0)* C20(IO_L56N_0) C21(IO_L65P_SCP3_0)* D5(IO_L3N_0)* D6(IO_L8P_0)* D7(IO_L13N_0)* D8(IO_L14P_0)* D10(IO_L19P_0)* D11(IO_L23P_0)* D12(IO_L31P_0)* D13(IO_L33N_0)* D14(IO_L36P_GCLK15_0)* D15(IO_L44N_0)* D19(IO_L54N_0)* D21(IO_L56P_0) E6(IO_L3P_0)* E8(IO_L13P_0)* E9(IO_L15N_0)* E10(IO_L18P_0)* E14(IO_L44P_0)* E19(IO_L54P_0)* F7(IO_L5N_0)* F9(IO_L15P_0)* F10(IO_L18N_0)* F11(IO_L23N_0)* F13(IO_L33P_0)* F18(IO_L57P_0)* G8(IO_L5P_0)* H15(IO_L51N_0)* H17(IO_L59N_0)* J15(IO_L51P_0)* K19(IO_L28N_VREF_1)* L19(IO_L28P_1)* P21(IO_L41P_GCLK9_IRDY1_M1RASN_1)* P22(IO_L41N_GCLK8_M1CASN_1)* R23(IO_L39P_M1A3_1)* R24(IO_L39N_M1ODT_1)* T23(IO_L53P_1)* T24(IO_L46P_FCS_B_M1DQ2_1)* T26(IO_L46N_FOE_B_M1DQ3_1)* U19(IO_L70P_1)* U24(IO_L53N_VREF_1)* U25(IO_L43P_GCLK5_M1DQ4_1)* U26(IO_L43N_GCLK4_M1DQ5_1)* V20(IO_L70N_1)* V22(IO_L71P_1)* V23(IO_L42P_GCLK7_M1UDM_1)* V24(IO_L45P_A1_M1LDQS_1)* V26(IO_L45N_A0_M1LDQSN_1)* W22(IO_L71N_1)* W24(IO_L42N_GCLK6_TRDY1_M1LDM_1)* W25(IO_L44P_A3_M1DQ6_1)* W26(IO_L44N_A2_M1DQ7_1)* Y20(IO_L72P_1)* Y21(IO_L72N_1)* Y22(IO_L73P_1)* Y24(IO_L47P_FWE_B_M1DQ0_1)* Y26(IO_L47N_LDC_M1DQ1_1)*

### Layout directives
differential pair: 100M_CLK_N, 100M_CLK_P, ADC_CLKOUT_N, ADC_CLKOUT_P, ADC_DA0_N, ADC_DA0_P, ADC_DA2_N, ADC_DA2_P, ADC_DA4_N, ADC_DA4_P, ADC_DA6_N, ADC_DA6_P, ADC_DA8_N, ADC_DA8_P, ADC_DA10_N, ADC_DA10_P, ADC_DA12_N, ADC_DA12_P, ADC_DB0_N, ADC_DB0_P, ADC_DB2_N, ADC_DB2_P, ADC_DB4_N, ADC_DB4_P, ADC_DB6_N, ADC_DB6_P, ADC_DB8_N, ADC_DB8_P, ADC_DB10_N, ADC_DB10_P, ADC_DB12_N, ADC_DB12_P, DAC_CLK_N, DAC_CLK_P, DAC_D0_N, DAC_D0_P, DAC_D1_N, DAC_D1_P, DAC_D2_N, DAC_D2_P, DAC_D3_N, DAC_D3_P, DAC_D4_N, DAC_D4_P, DAC_D5_N, DAC_D5_P, DAC_D6_N, DAC_D6_P, DAC_D7_N, DAC_D7_P, DAC_FRAME_N, DAC_FRAME_P

### Notes on the sheet
- 0.05A @ 3V3D
- 0.1A (3V3D)
- Sheet Name
- Project Title
- Global Project
- Size
- Group
- Revision
- Date
- Sheet
- of
- Filename
- Designers
- (in symbol FPGA_XC6SLX100-3FGG676C, part A) BANK 0
- (in symbol FPGA_XC6SLX100-3FGG676C, part B) BANK 1

### Library data of the parts
C49 C54 = CAP - 1210: Precision: 10%; Current: *; CreatedBy: Jonathan Bouchard; Power: *
C50 C55 = CAP - 0805: Precision: 10%; Current: *; CreatedBy: Jonathan Bouchard; Power: *
C51-C53 C56-C58 = CAP - 0402: Precision: 10%; Current: *; CreatedBy: Jonathan Bouchard; Power: *
R27 = RES_RMCF0402FT10R0: RES - 10R 1% 1/16W - 0402; Manufacturer #1: Stackpole Electronics Inc.; Current Rating: 1A; GRAMS Lib Spec: 2.8; Magnetic Material: Unknown; Polarized: No; Voltage Rating: 50V; Assembly Type: SMD; CreatedBy/Date: Joel Lemay 2018-07-04; HelpURL: https://www.seielect.com/Catalog/SEI-RMCF_RMCP.pdf; Manufacturer #2: Panasonic; Part Number #1: RMCF0402FT10R0; Part Number #2: ERJ-2RKF10R0X; Power Max: 1/16W; Temperature: -55°C ~ 155°C; VerifiedBy: Caroline Paulin - 6 sept 2018; Supplier 1: Digi-Key; Supplier Part Number 1: RMCF0402FT10R0CT-ND; Cryo: UNKNOWN
U13 = FPGA_XC6SLX100-3FGG676C: FPGA - XILINX SPARTAN 6 480 I/O - BGA-676; Voltage: 1.14 V ~ 1.26 V; Current: *; Power: *; Mfg: Xilinx; Mfg Part Number: XC6SLX100-3FGG676C; HelpURL: https://www.xilinx.com/support/documentation/data_sheets/ds162.pdf; CreatedBy: Jonathan Bouchard; Temperature: 0°C ~ 85°C (TJ); Value: *; Precision: *; Package: BGA-676; Supplier 1: Digikey; Supplier Part Number 1: 122-1760-ND